# EAGLE design BPS6002_LogicStart_Shield (EAGLE 6.6.0)
DATABASE: E:\Dropbox\GadgetFactory\GadgetFactory_Engineering\Libraries\GadgetFactory-PARTSDB.txt

## Sheet 1 of 7: Pinouts
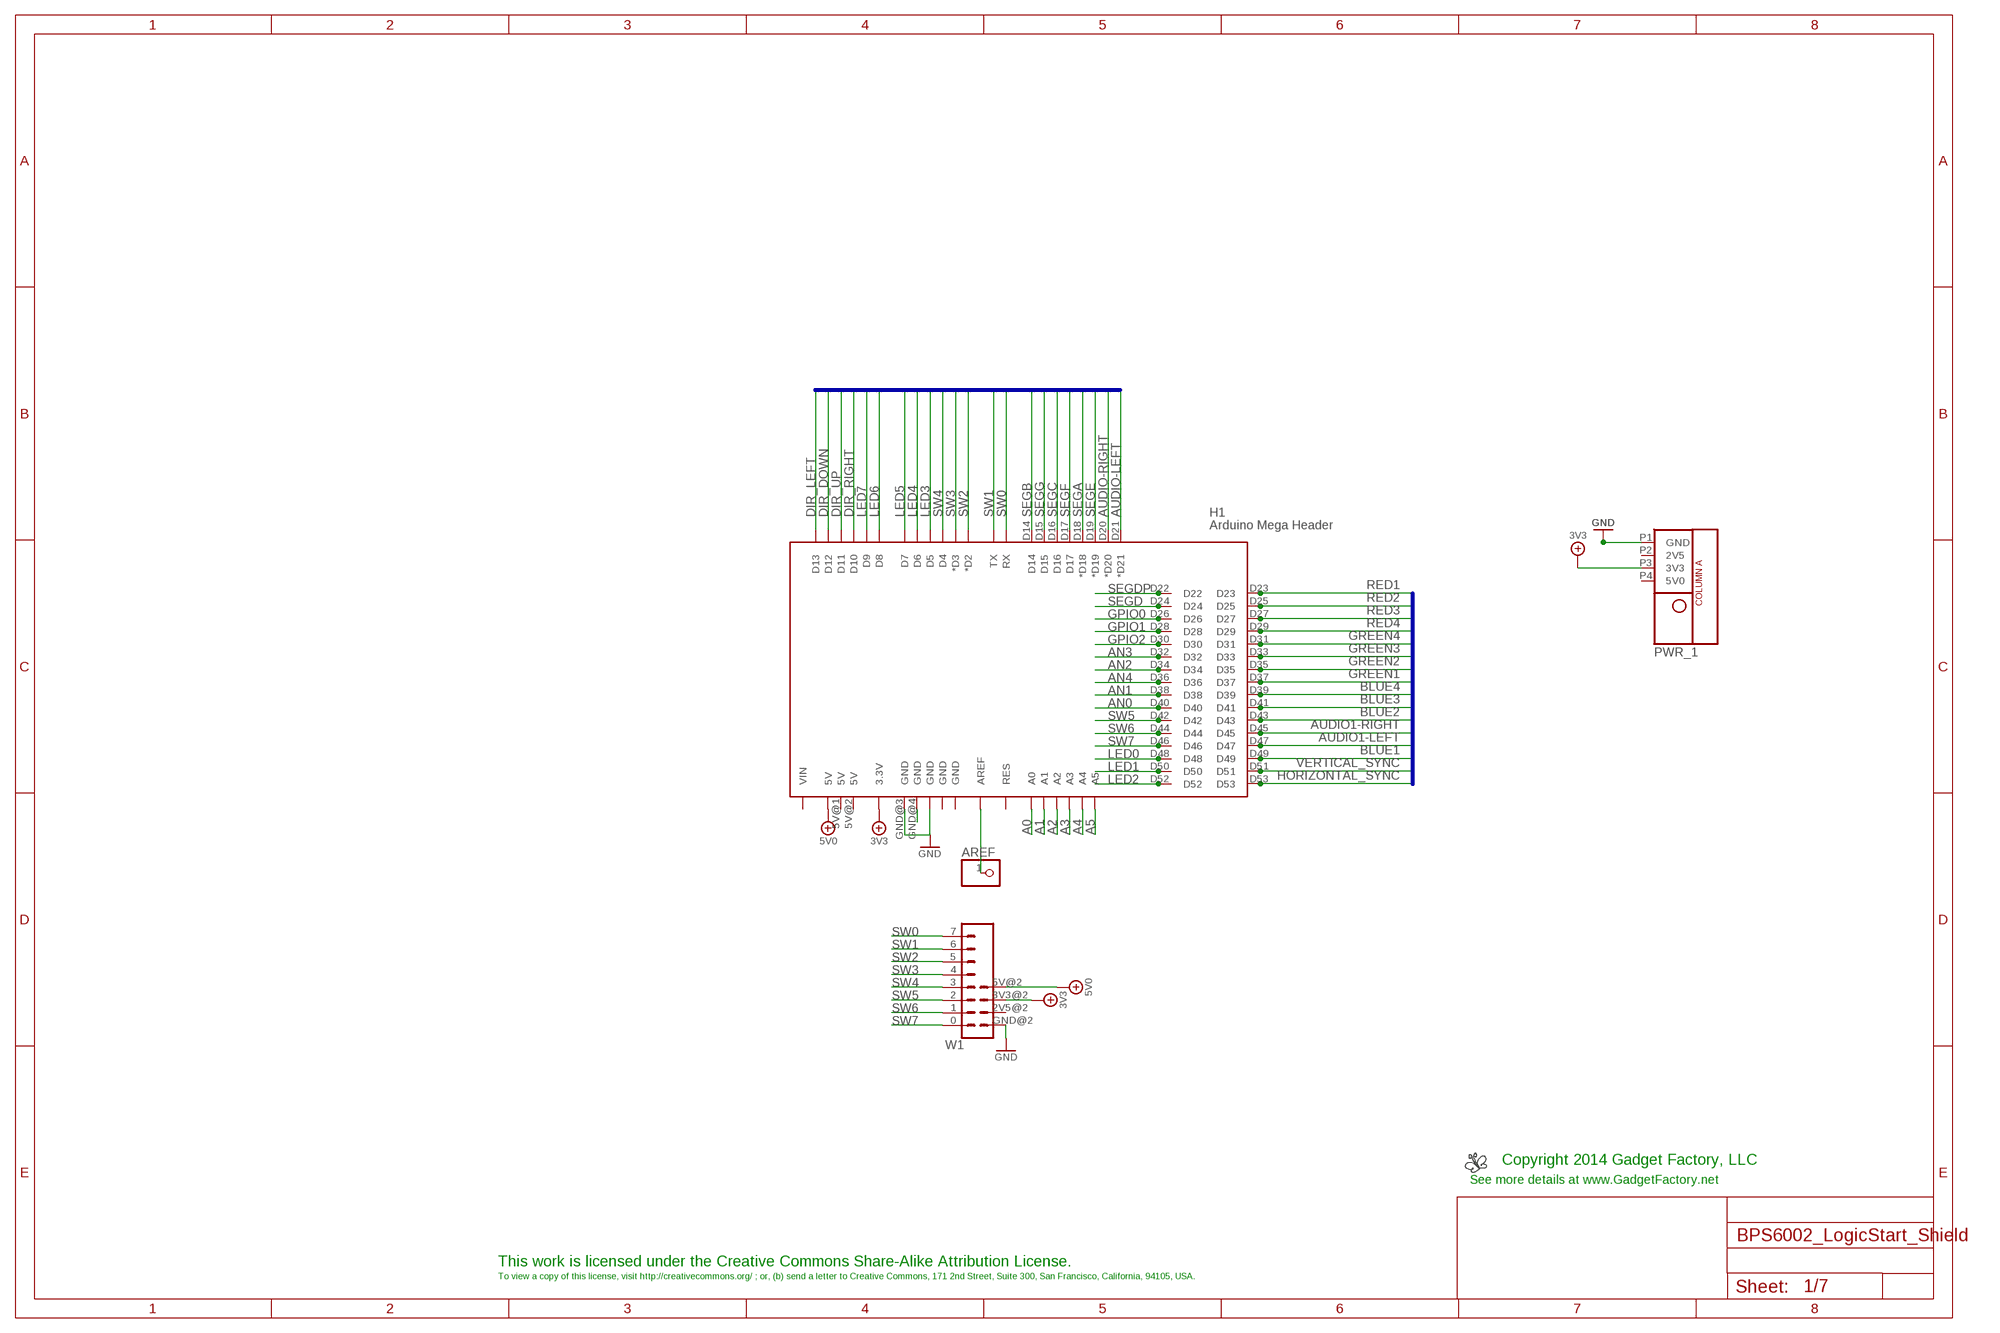
[diagram p0: schematic, sheet 1]

### Parts
AREF  PINHD-1X1  [1X01]
H1  Arduino Mega Header  PAPILIO_DUO_SHIELD  [PAPILIO_DUO_SHIELD]
LOGO1  BUTTERFLY_LOGO  [BUTTERFLY_LOGO]
PWR_1  POWER_ONLYNOTEXT  [POWER_NO_TEXT]
W1  WING8_NOHOLES_FEMALE_TOP  WING8WING8_NOHOLES  [WINGSIDE_8BIT_NOHOLES]

### Nets
3V3: H1.3.3V W1.3V3@2(3V3) ; also sheet 2,5,6,7
5V0: H1.5V@0(5V) W1.5V@2(5V)
A0: H1.A0 ; also sheet 5
A1: H1.A1 ; also sheet 5
A2: H1.A2 ; also sheet 5
A3: H1.A3 ; also sheet 5
A4: H1.A4 ; also sheet 5
A5: H1.A5 ; also sheet 5
AN0: H1.D40 ; also sheet 6
AN1: H1.D38 ; also sheet 6
AN2: H1.D34 ; also sheet 6
AN3: H1.D32 ; also sheet 6
AN4: H1.D36 ; also sheet 6
AUDIO1-LEFT: H1.D47
AUDIO1-RIGHT: H1.D45
AUDIO-LEFT: H1.D21(*D21) ; also sheet 3
AUDIO-RIGHT: H1.D20(*D20) ; also sheet 3
BLUE1: H1.D49 ; also sheet 4
BLUE2: H1.D43 ; also sheet 4
BLUE3: H1.D41 ; also sheet 4
BLUE4: H1.D39 ; also sheet 4
DIR_DOWN: H1.D12 ; also sheet 7
DIR_LEFT: H1.D13 ; also sheet 7
DIR_RIGHT: H1.D10 ; also sheet 7
DIR_UP: H1.D11 ; also sheet 7
GND: H1.GND@2(GND) H1.GND@3(GND) W1.GND@2(GND) ; also sheet 2,3,5,7
GPIO0: H1.D26 ; also sheet 2
GPIO1: H1.D28 ; also sheet 2
GPIO2: H1.D30 ; also sheet 2
GREEN1: H1.D37 ; also sheet 4
GREEN2: H1.D35 ; also sheet 4
GREEN3: H1.D33 ; also sheet 4
GREEN4: H1.D31 ; also sheet 4
HORIZONTAL_SYNC: H1.D53 ; also sheet 4
LED0: H1.D48 ; also sheet 2
LED1: H1.D50 ; also sheet 2
LED2: H1.D52 ; also sheet 2
LED3: H1.D5 ; also sheet 2
LED4: H1.D6 ; also sheet 2
LED5: H1.D7 ; also sheet 2
LED6: H1.D8 ; also sheet 2
LED7: H1.D9 ; also sheet 2
N$9: AREF.1 H1.AREF
RED1: H1.D23 ; also sheet 4
RED2: H1.D25 ; also sheet 4
RED3: H1.D27 ; also sheet 4
RED4: H1.D29 ; also sheet 4
SEGA: H1.D18(*D18) ; also sheet 6
SEGB: H1.D14 ; also sheet 6
SEGC: H1.D16 ; also sheet 6
SEGD: H1.D24 ; also sheet 6
SEGDP: H1.D22 ; also sheet 6
SEGE: H1.D19(*D19) ; also sheet 6
SEGF: H1.D17 ; also sheet 6
SEGG: H1.D15 ; also sheet 6
SW0: H1.RX W1.7 ; also sheet 2
SW1: H1.TX W1.6 ; also sheet 2
SW2: H1.D2(*D2) W1.5 ; also sheet 2
SW3: H1.D3(*D3) W1.4 ; also sheet 2
SW4: H1.D4 W1.3 ; also sheet 2
SW5: H1.D42 W1.2 ; also sheet 2
SW6: H1.D44 W1.1 ; also sheet 2
SW7: H1.D46 W1.0 ; also sheet 2
VERTICAL_SYNC: H1.D51 ; also sheet 4
WING_3V3: PWR_1.P3(3V3) ; supply symbol labelled 3V3
WING_GND: H1.GND@4(GND) PWR_1.P1(GND) ; supply symbol labelled GND ; also sheet 4
Unconnected: H1.5V@1(5V) H1.5V@2(5V) H1.GND@0(GND) H1.GND@1(GND) H1.RES H1.VIN PWR_1.P2(2V5) PWR_1.P4(5V0) W1.2V5@2(2V5)

### Buses
LED[1..4],JS1_[1..9],JS2_[1..9],AUDIO-,AUDIO+,PS2CLK1,PS2CLK2,PS2DAT1,PS2DAT2,RED[1..4],GREEN[1..4],BLUE[1..4],SW[1..4],RESET,HORIZONTAL_SYNC

### Notes on the sheet
- Copyright 2014 Gadget Factory, LLC
- See more details at www.GadgetFactory.net
- This work is licensed under the Creative Commons Share-Alike Attribution License.
- To view a copy of this license, visit http://creativecommons.org/ ; or, (b) send a letter to Creative Commons, 171 2nd Street, Suite 300, San Francisco, California, 94105, USA.

## Sheet 2 of 7: Switches/LEDs
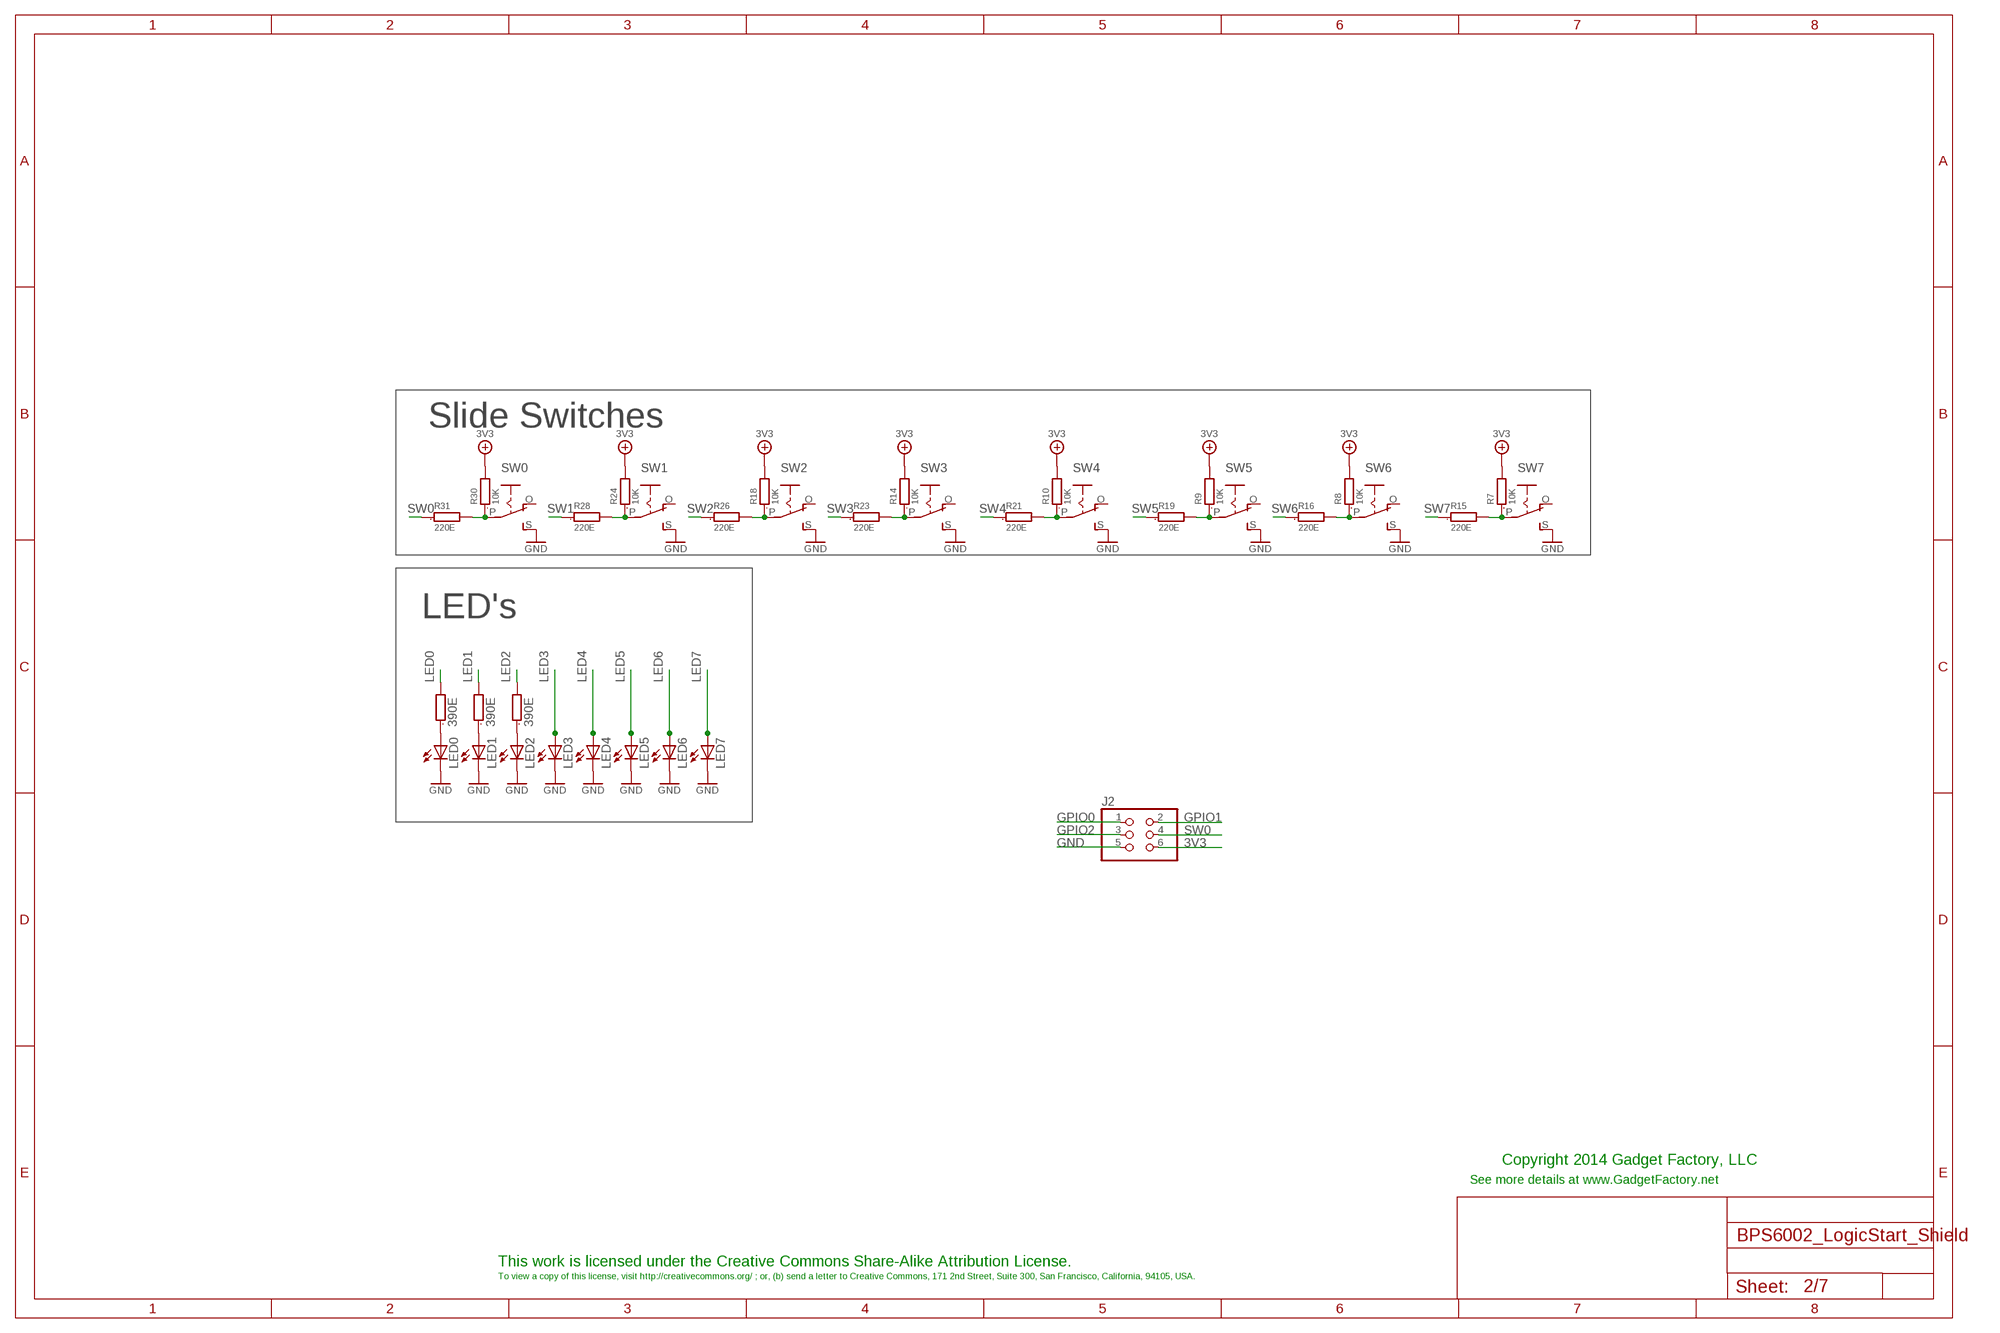
[diagram p1: schematic, sheet 2]

### Parts
J2  PINHD-2X3  [2X03]
LED0  LEDCHIPLED_0805  [CHIPLED_0805]
LED1  LEDCHIPLED_0805  [CHIPLED_0805]
LED2  LEDCHIPLED_0805  [CHIPLED_0805]
LED3  LEDCHIPLED_0805  [CHIPLED_0805]
LED4  LEDCHIPLED_0805  [CHIPLED_0805]
LED5  LEDCHIPLED_0805  [CHIPLED_0805]
LED6  LEDCHIPLED_0805  [CHIPLED_0805]
LED7  LEDCHIPLED_0805  [CHIPLED_0805]
R7  10K  R0603  [0603]
R8  10K  R0603  [0603]
R9  10K  R0603  [0603]
R10  10K  R0603  [0603]
R11  390E  R0603  [0603]
R12  390E  R0603  [0603]
R13  390E  R0603  [0603]
R14  10K  R0603  [0603]
R15  220E  R0603  [0603]
R16  220E  R0603  [0603]
R18  10K  R0603  [0603]
R19  220E  R0603  [0603]
R21  220E  R0603  [0603]
R23  220E  R0603  [0603]
R24  10K  R0603  [0603]
R26  220E  R0603  [0603]
R28  220E  R0603  [0603]
R30  10K  R0603  [0603]
R31  220E  R0603  [0603]
SW0  EG1218S  [EG1218]
SW1  EG1218S  [EG1218]
SW2  EG1218S  [EG1218]
SW3  EG1218S  [EG1218]
SW4  EG1218S  [EG1218]
SW5  EG1218S  [EG1218]
SW6  EG1218S  [EG1218]
SW7  EG1218S  [EG1218]

### Nets
3V3: J2.6 R7.2 R8.2 R9.2 R10.2 R14.2 R18.2 R24.2 R30.2 ; also sheet 1,5,6,7
GND: J2.5 LED0.C LED1.C LED2.C LED3.C LED4.C LED5.C LED6.C LED7.C SW0.S SW1.S SW2.S SW3.S SW4.S SW5.S SW6.S SW7.S ; also sheet 1,3,5,7
GPIO0: J2.1 ; also sheet 1
GPIO1: J2.2 ; also sheet 1
GPIO2: J2.3 ; also sheet 1
LED0: R13.2 ; also sheet 1
LED1: R12.2 ; also sheet 1
LED2: R11.2 ; also sheet 1
LED3: LED3.A ; also sheet 1
LED4: LED4.A ; also sheet 1
LED5: LED5.A ; also sheet 1
LED6: LED6.A ; also sheet 1
LED7: LED7.A ; also sheet 1
N$19: LED0.A R13.1
N$20: LED1.A R12.1
N$21: LED2.A R11.1
SW0: J2.4 R31.1 ; also sheet 1
SW0_JOY_UP_IN: R30.1 R31.2 SW0.P
SW1: R28.1 ; also sheet 1
SW1__JOY_DOWN_IN: R24.1 R28.2 SW1.P
SW2: R26.1 ; also sheet 1
SW2_JOY_SELECT_IN: R18.1 R26.2 SW2.P
SW3: R23.1 ; also sheet 1
SW3_JOY_RIGHT_IN: R14.1 R23.2 SW3.P
SW4: R21.1 ; also sheet 1
SW4_JOY_LEFT_IN: R10.1 R21.2 SW4.P
SW5: R19.1 ; also sheet 1
SW5_IN: R9.1 R19.2 SW5.P
SW6: R16.1 ; also sheet 1
SW6_IN: R8.1 R16.2 SW6.P
SW7: R15.1 ; also sheet 1
SW7_IN: R7.1 R15.2 SW7.P
Unconnected: SW0.O SW1.O SW2.O SW3.O SW4.O SW5.O SW6.O SW7.O

### Notes on the sheet
- Slide Switches
- LED's
- Copyright 2014 Gadget Factory, LLC
- See more details at www.GadgetFactory.net
- This work is licensed under the Creative Commons Share-Alike Attribution License.
- To view a copy of this license, visit http://creativecommons.org/ ; or, (b) send a letter to Creative Commons, 171 2nd Street, Suite 300, San Francisco, California, 94105, USA.

## Sheet 3 of 7: Audio
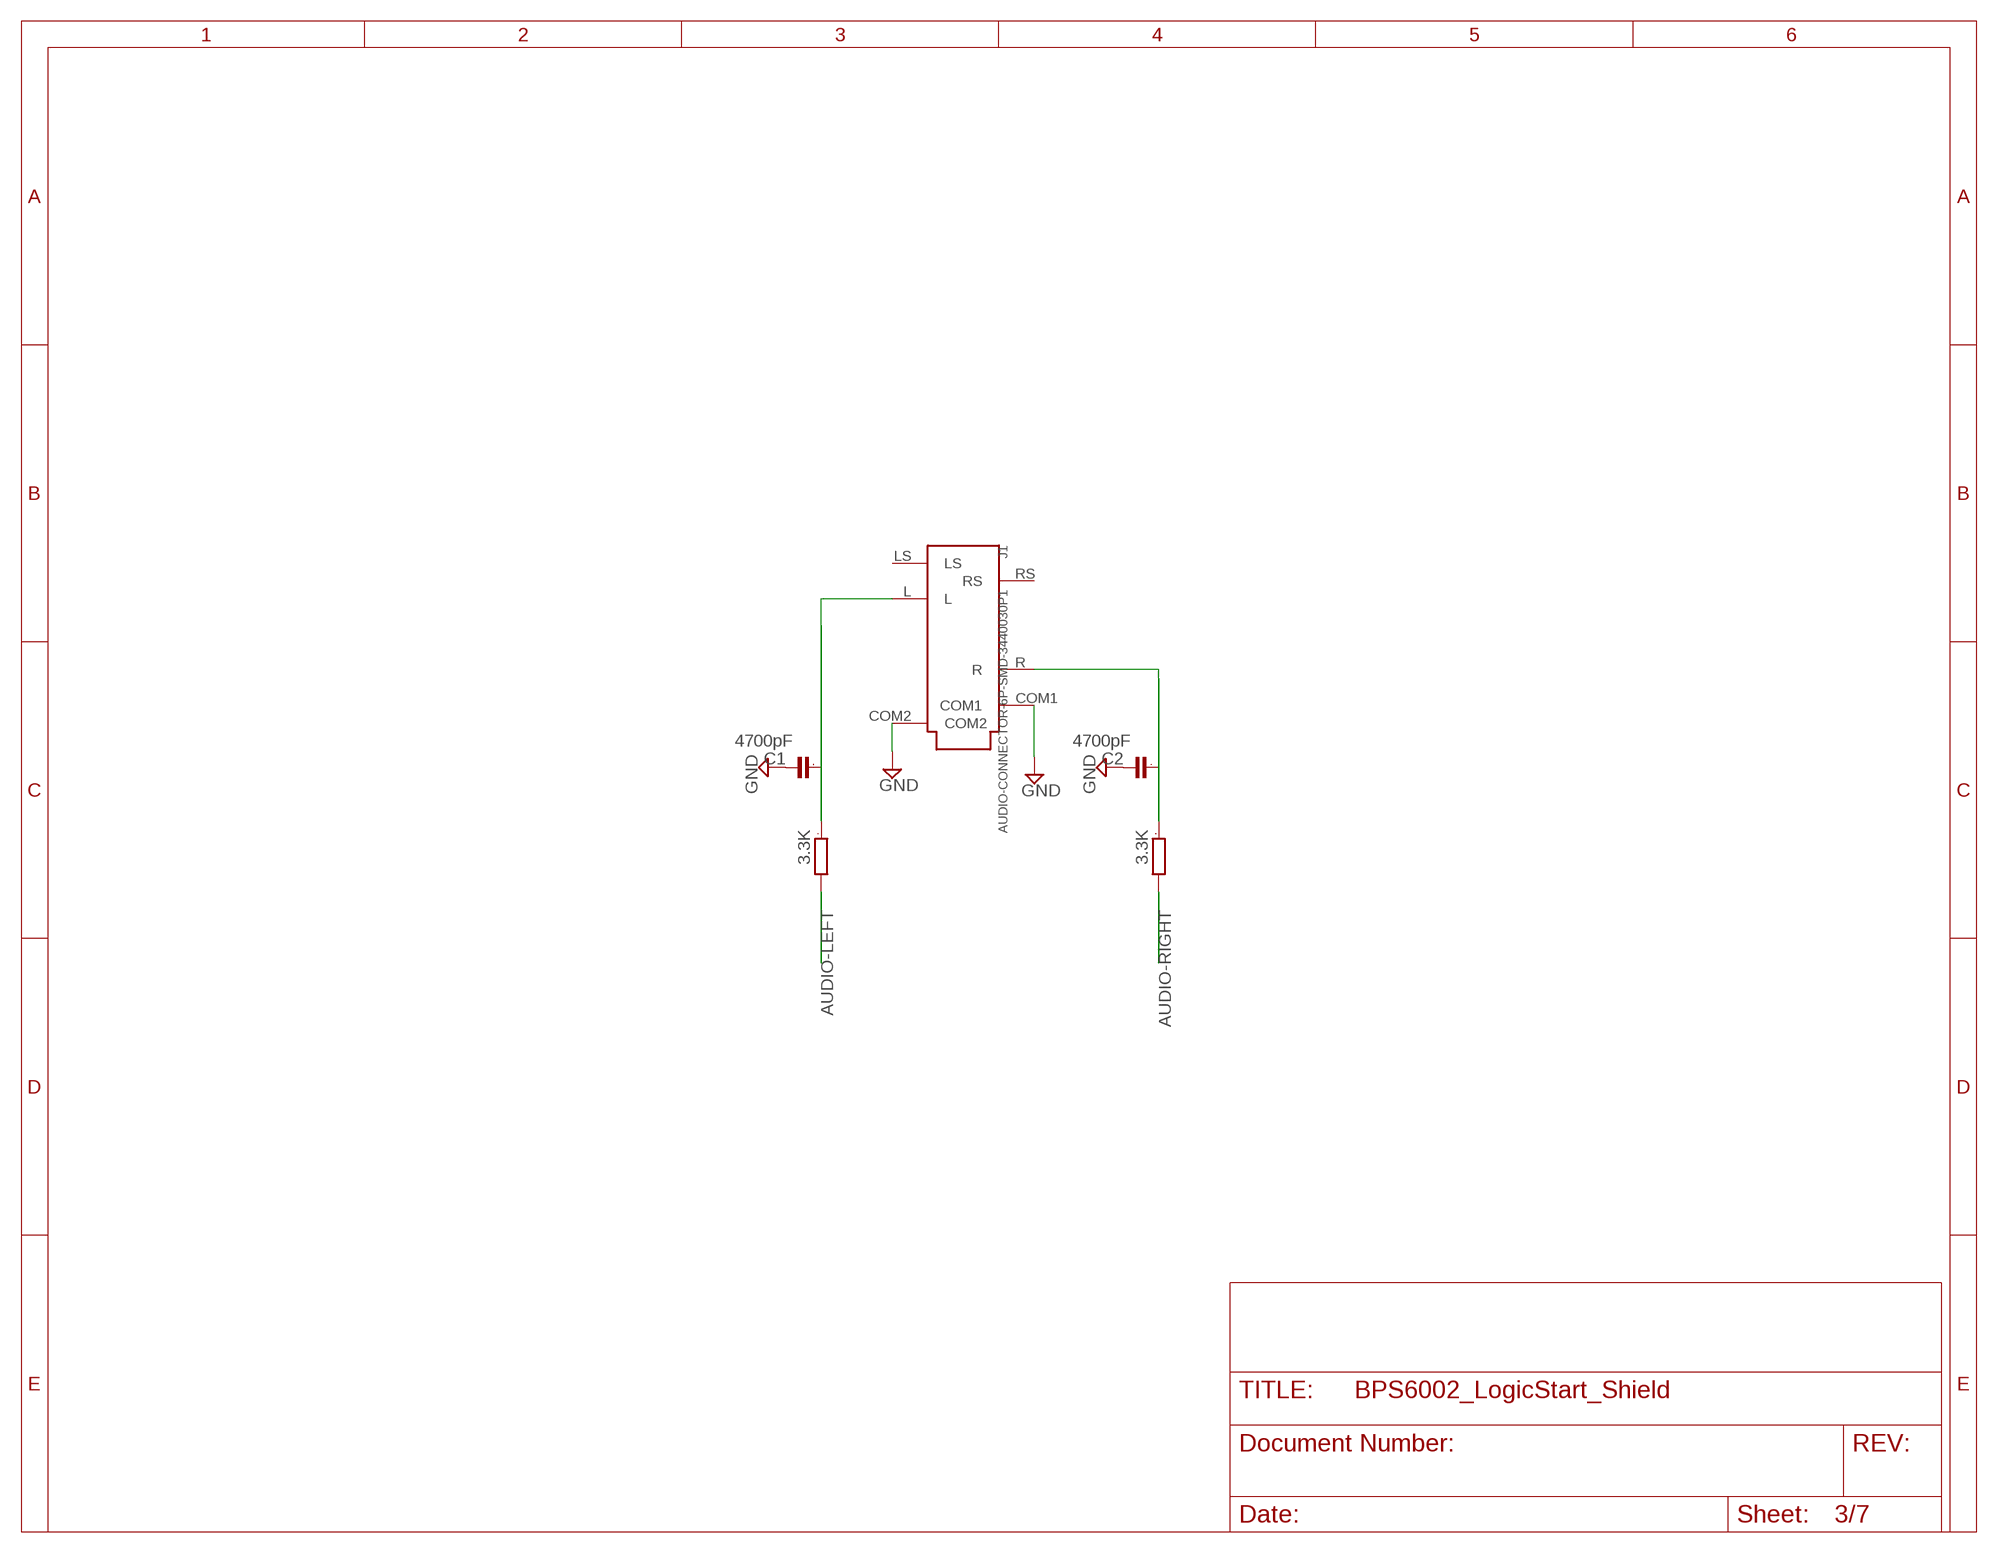
[diagram p2: schematic, sheet 3]

### Parts
C1  4700pF  C0603  [0603]
C2  4700pF  C0603  [0603]
J1  AUDIO-CONNECTOR-6P-SMD-3440030P1  [6P-SMD-3.5]
R2  3.3K  R0603  [0603]
R3  3.3K  R0603  [0603]

### Nets
AUDIO-LEFT: R2.2 ; also sheet 1
AUDIO-RIGHT: R3.2 ; also sheet 1
GND: C1.2 C2.2 J1.COM1 J1.COM2 ; also sheet 1,2,5,7
N$1: C1.1 J1.L R2.1
N$33: C2.1 J1.R R3.1
Unconnected: J1.LS J1.RS

## Sheet 4 of 7: VGA
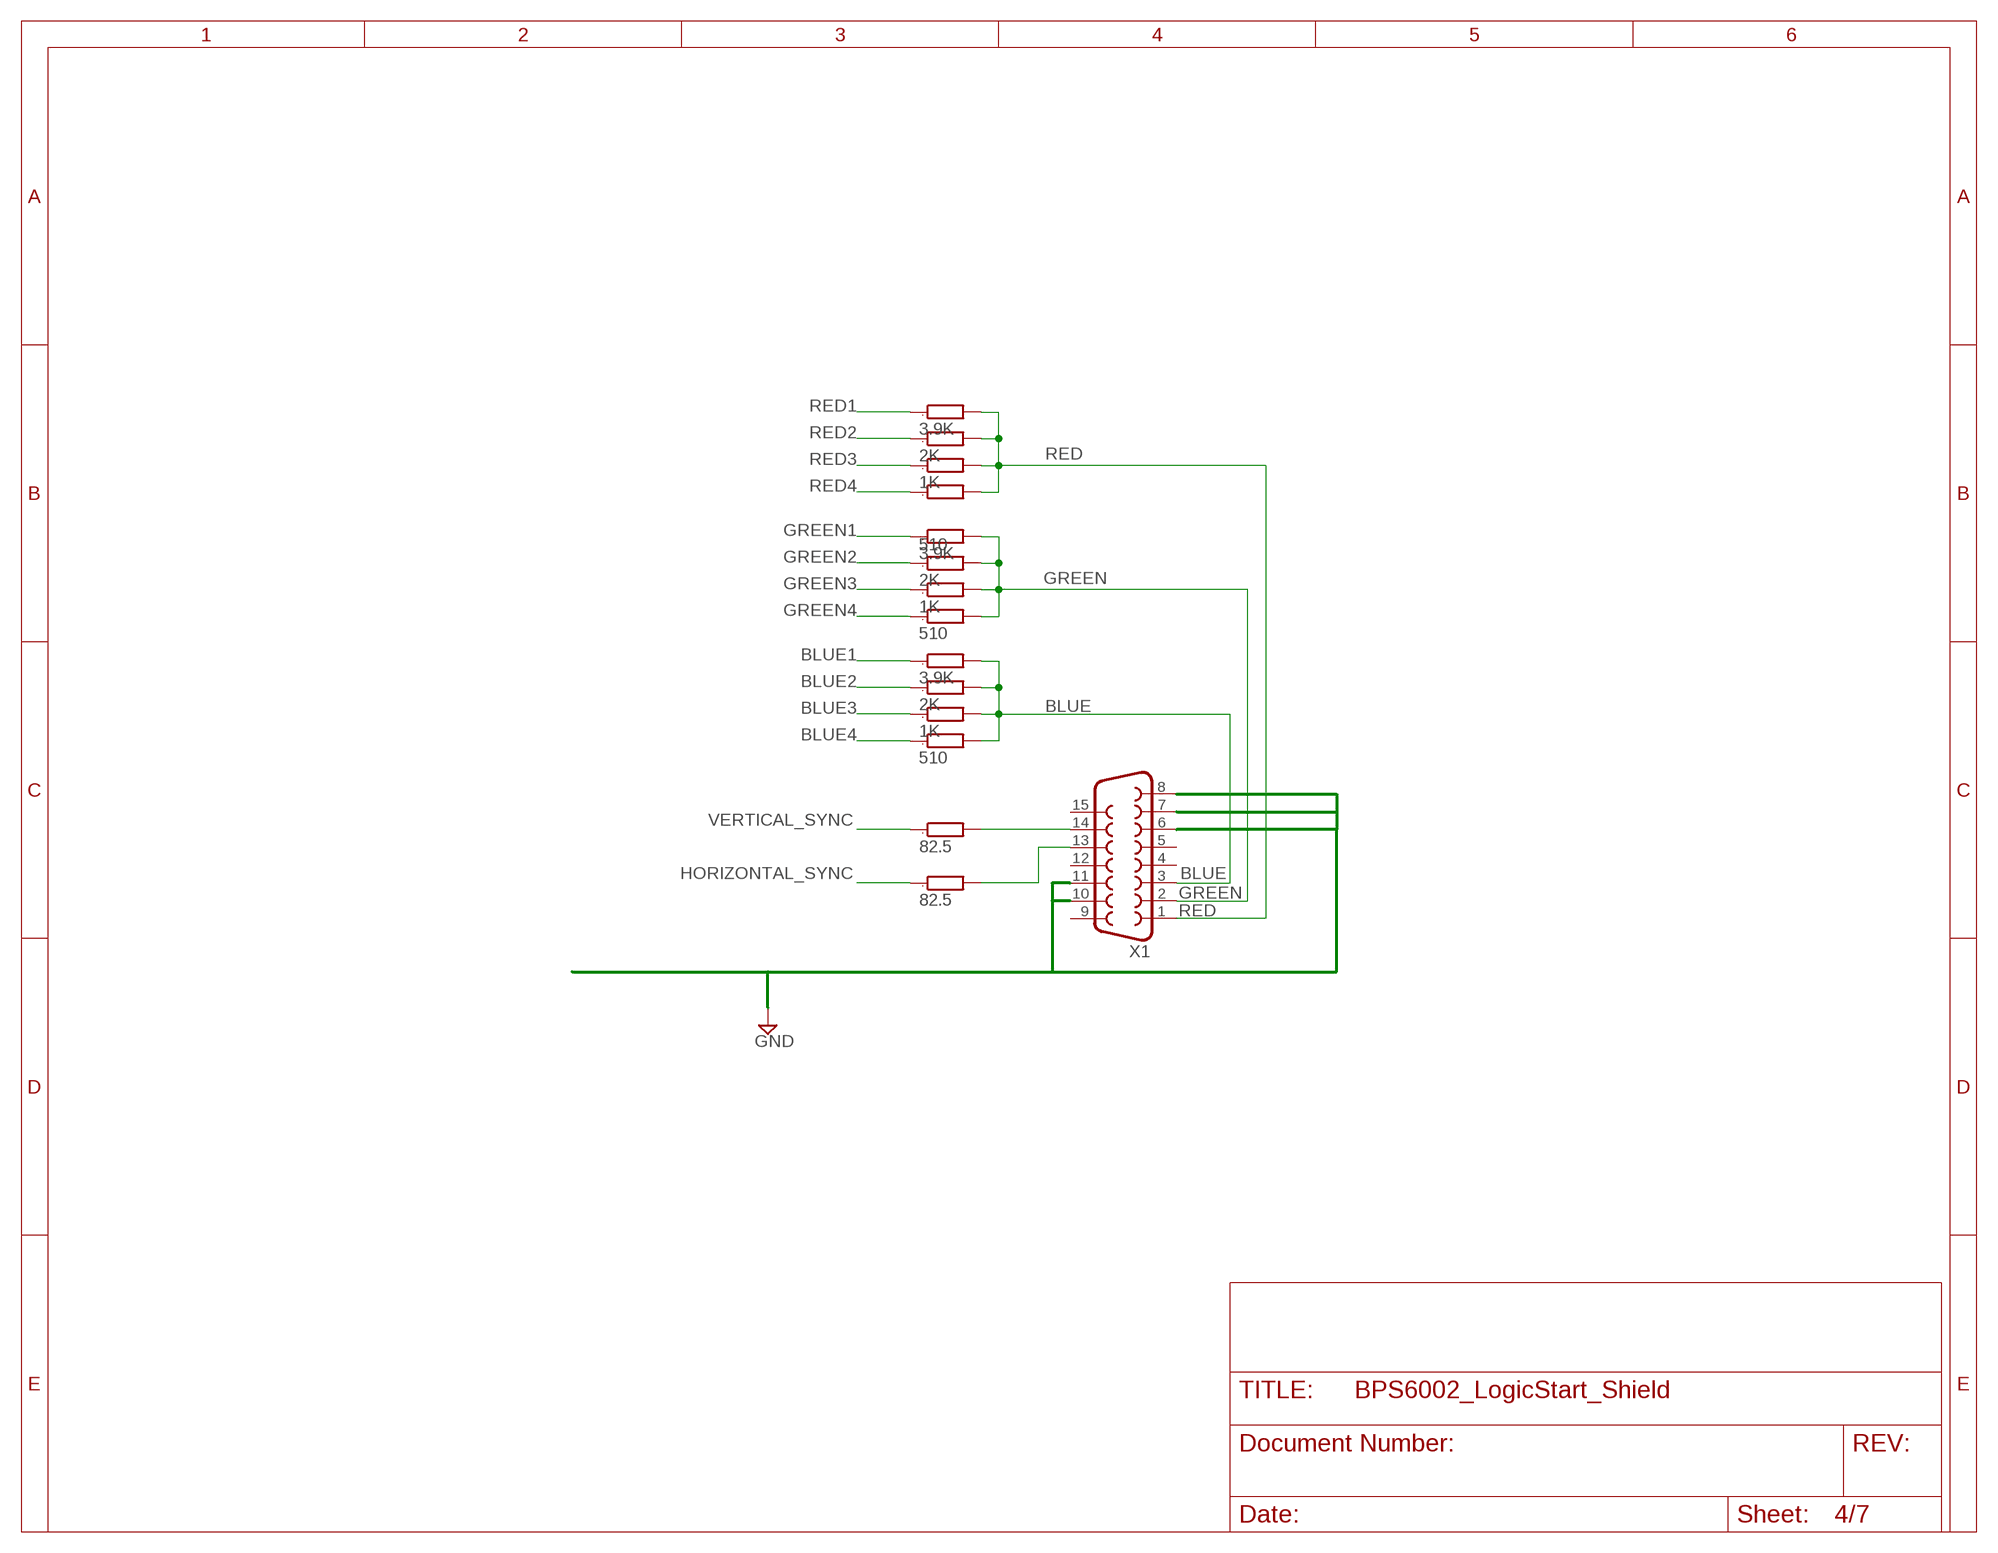
[diagram p3: schematic, sheet 4]

### Parts
R34  3.9K  R0603  [0603]
R35  2K  R0603  [0603]
R36  1K  R0603  [0603]
R37  510  R0603  [0603]
R38  510  R0603  [0603]
R39  1K  R0603  [0603]
R40  2K  R0603  [0603]
R41  3.9K  R0603  [0603]
R42  510  R0603  [0603]
R43  1K  R0603  [0603]
R44  2K  R0603  [0603]
R45  3.9K  R0603  [0603]
R46  82.5  R0603  [0603]
R47  82.5  R0603  [0603]
X1  F15HDH  [HDF15H]

### Nets
BLUE: R42.2 R43.2 R44.2 R45.2 X1.3
BLUE1: R45.1 ; also sheet 1
BLUE2: R44.1 ; also sheet 1
BLUE3: R43.1 ; also sheet 1
BLUE4: R42.1 ; also sheet 1
GREEN: R38.2 R39.2 R40.2 R41.2 X1.2
GREEN1: R41.1 ; also sheet 1
GREEN2: R40.1 ; also sheet 1
GREEN3: R39.1 ; also sheet 1
GREEN4: R38.1 ; also sheet 1
HORIZONTAL_SYNC: R47.1 ; also sheet 1
N$4: R47.2 X1.13
N$5: R46.2 X1.14
RED: R34.2 R35.2 R36.2 R37.2 X1.1
RED1: R34.1 ; also sheet 1
RED2: R35.1 ; also sheet 1
RED3: R36.1 ; also sheet 1
RED4: R37.1 ; also sheet 1
VERTICAL_SYNC: R46.1 ; also sheet 1
WING_GND: X1.6 X1.7 X1.8 X1.10 X1.11 ; supply symbol labelled GND ; also sheet 1
Unconnected: X1.4 X1.5 X1.9 X1.12 X1.15

## Sheet 5 of 7: ANALOG
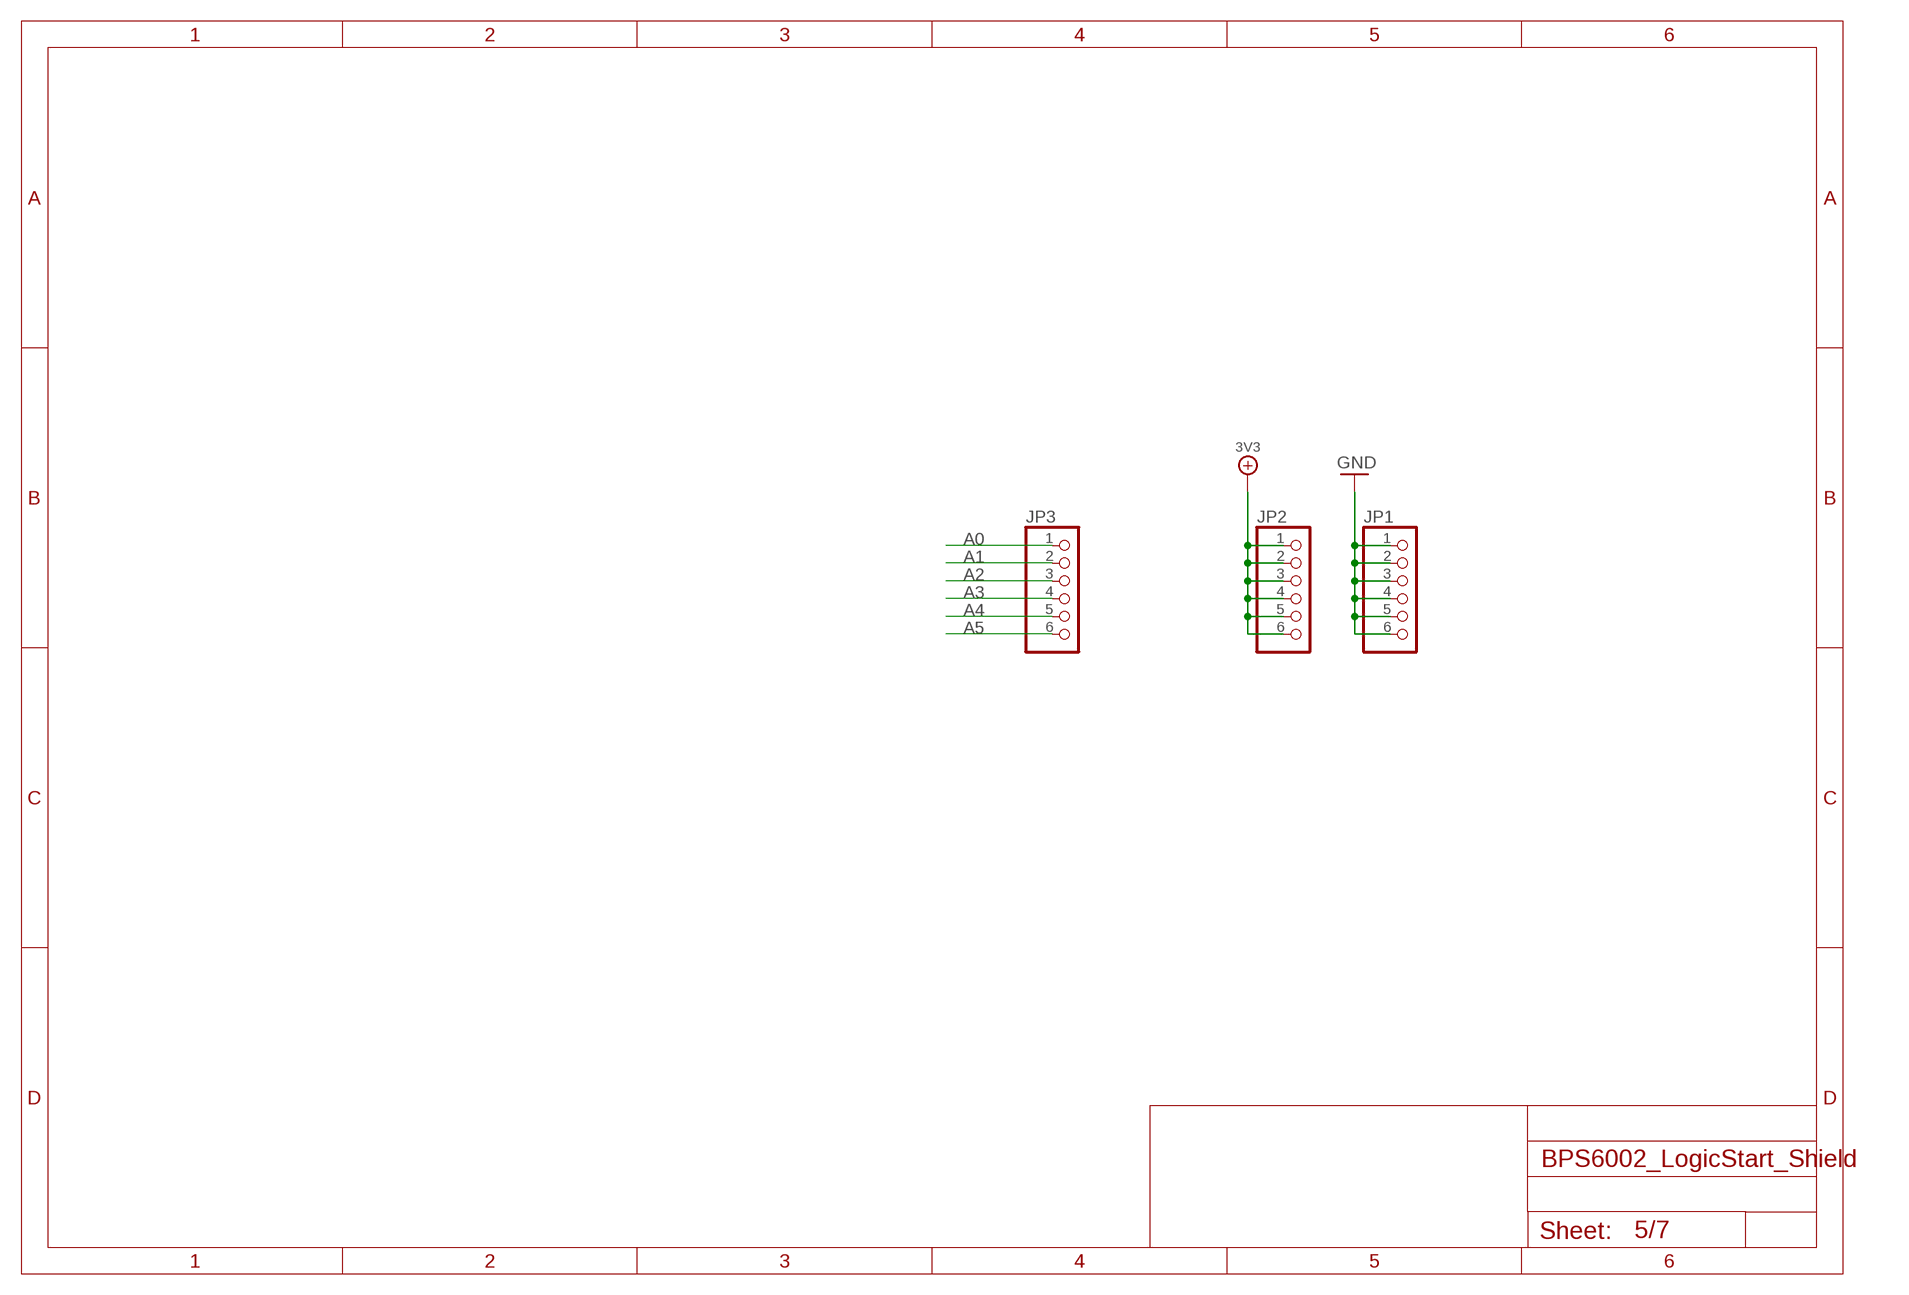
[diagram p4: schematic, sheet 5]

### Parts
JP1  PINHD-1X6  [1X06]
JP2  PINHD-1X6  [1X06]
JP3  PINHD-1X6  [1X06]

### Nets
3V3: JP2.1 JP2.2 JP2.3 JP2.4 JP2.5 JP2.6 ; also sheet 1,2,6,7
A0: JP3.1 ; also sheet 1
A1: JP3.2 ; also sheet 1
A2: JP3.3 ; also sheet 1
A3: JP3.4 ; also sheet 1
A4: JP3.5 ; also sheet 1
A5: JP3.6 ; also sheet 1
GND: JP1.1 JP1.2 JP1.3 JP1.4 JP1.5 JP1.6 ; also sheet 1,2,3,7

## Sheet 6 of 7: Seven Segment LCD
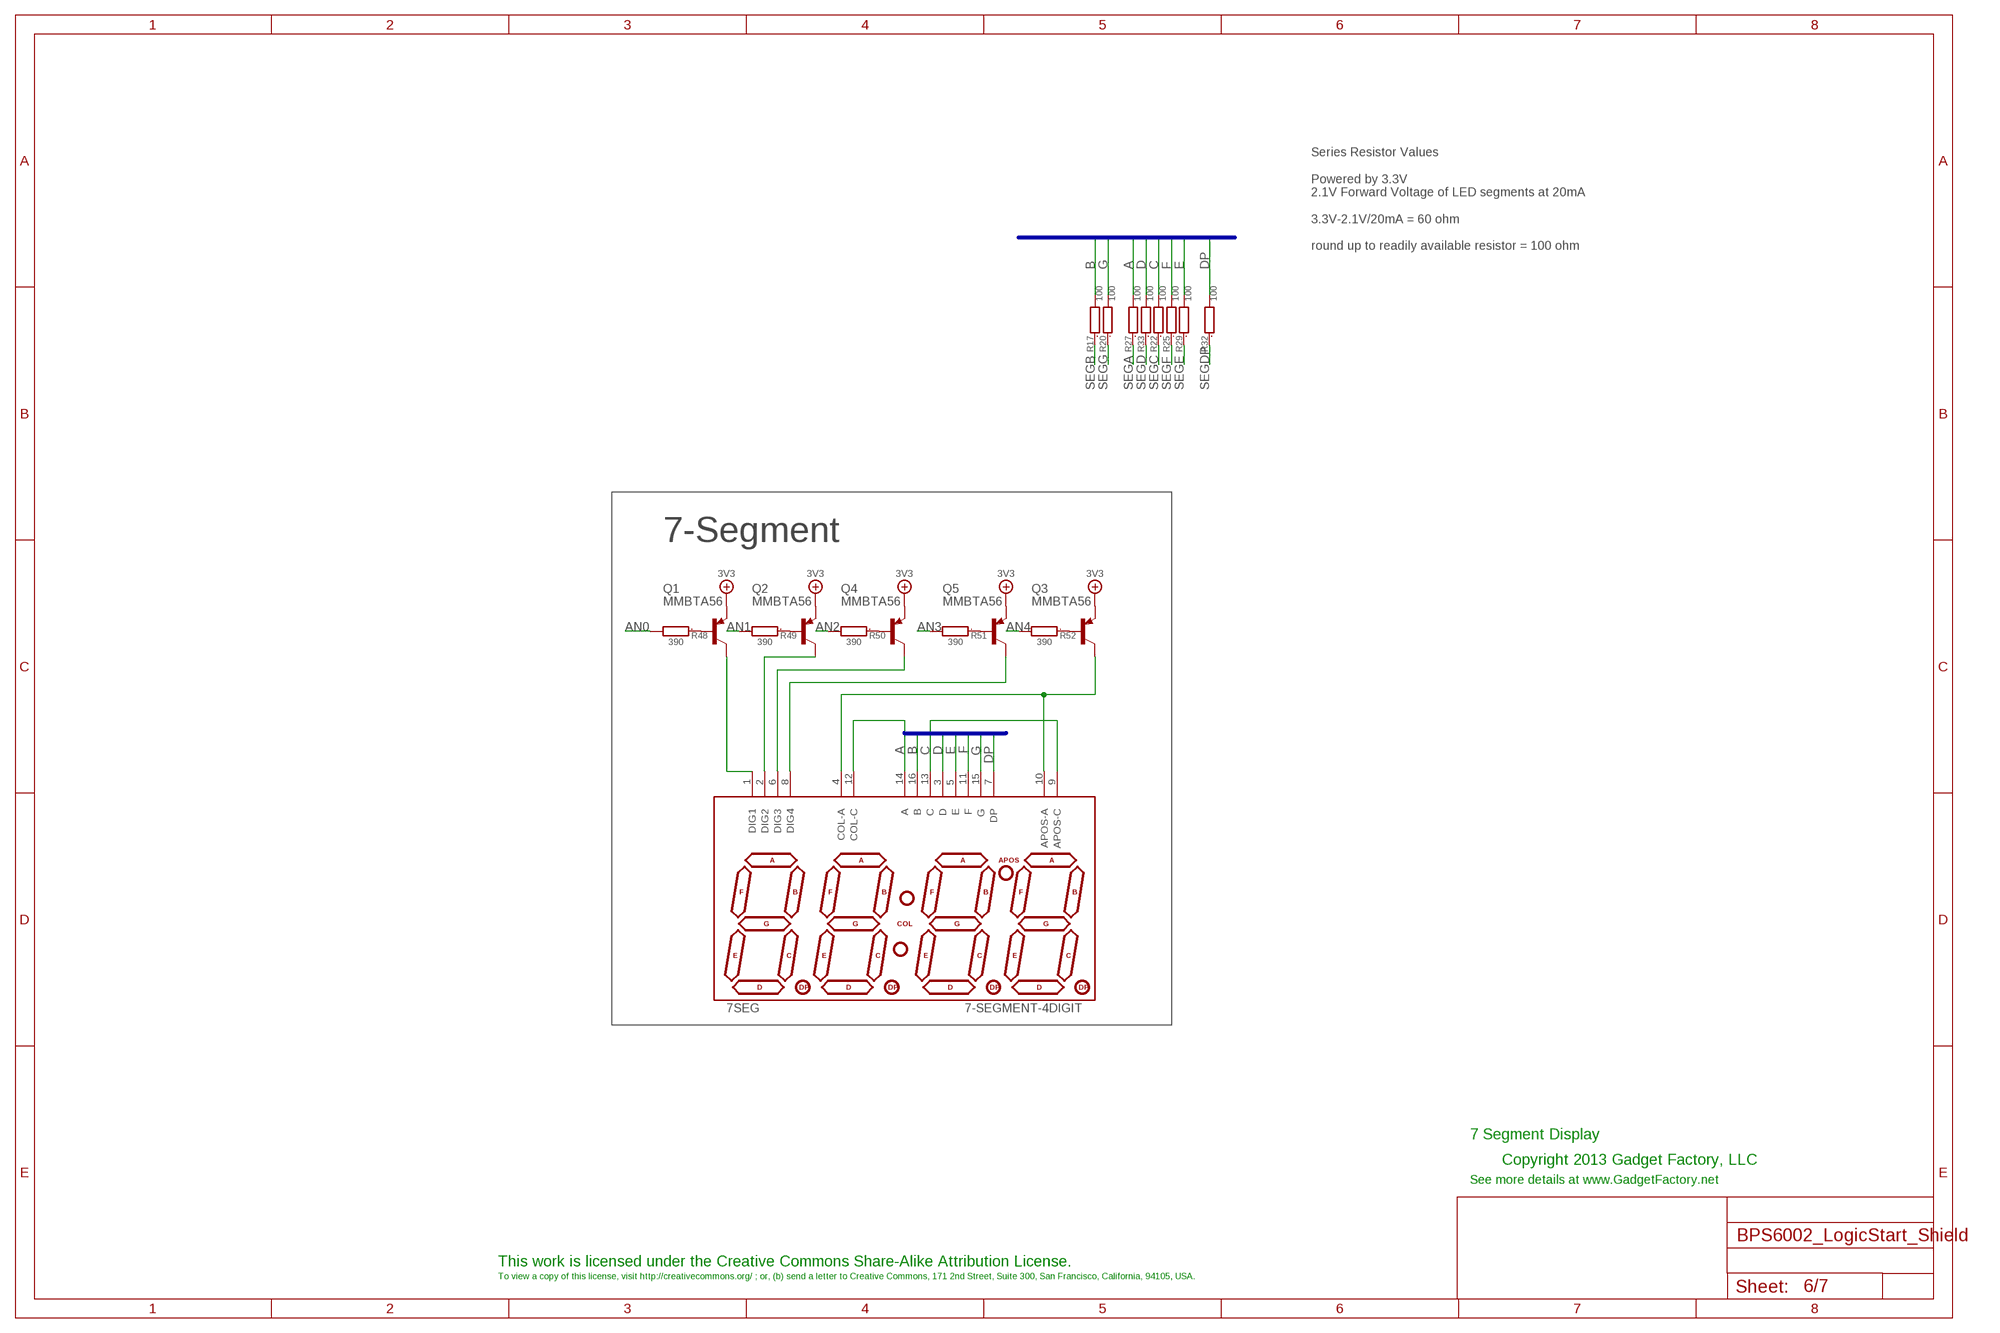
[diagram p5: schematic, sheet 6]

### Parts
7SEG  7-SEGMENT-4DIGIT  [7-SEGMENT-4DIGIT]
Q1  MMBTA56  MMBTA56-SOT23  [SOT23]
Q2  MMBTA56  MMBTA56-SOT23  [SOT23]
Q3  MMBTA56  MMBTA56-SOT23  [SOT23]
Q4  MMBTA56  MMBTA56-SOT23  [SOT23]
Q5  MMBTA56  MMBTA56-SOT23  [SOT23]
R17  100  R0603  [0603]
R20  100  R0603  [0603]
R22  100  R0603  [0603]
R25  100  R0603  [0603]
R27  100  R0603  [0603]
R29  100  R0603  [0603]
R32  100  R0603  [0603]
R33  100  R0603  [0603]
R48  390  R0603  [0603]
R49  390  R0603  [0603]
R50  390  R0603  [0603]
R51  390  R0603  [0603]
R52  390  R0603  [0603]

### Nets
3V3: Q1.2(E) Q2.2(E) Q3.2(E) Q4.2(E) Q5.2(E) ; also sheet 1,2,5,7
A: 7SEG.12(COL-C) 7SEG.14(A) R27.2
AN0: R48.2 ; also sheet 1
AN1: R49.2 ; also sheet 1
AN2: R50.2 ; also sheet 1
AN3: R51.2 ; also sheet 1
AN4: R52.2 ; also sheet 1
APOS_A: 7SEG.4(COL-A) 7SEG.10(APOS-A) Q3.3(C)
B: 7SEG.16(B) R17.2
C: 7SEG.9(APOS-C) 7SEG.13(C) R22.2
D: 7SEG.3(D) R33.2
DP: 7SEG.7(DP) R32.2
E: 7SEG.5(E) R29.2
F: 7SEG.11(F) R25.2
G: 7SEG.15(G) R20.2
N$2: Q1.1(B) R48.1
N$3: Q2.1(B) R49.1
N$6: Q4.1(B) R50.1
N$7: Q5.1(B) R51.1
N$8: Q3.1(B) R52.1
N$29: 7SEG.1(DIG1) Q1.3(C)
N$30: 7SEG.2(DIG2) Q2.3(C)
N$31: 7SEG.6(DIG3) Q4.3(C)
N$32: 7SEG.8(DIG4) Q5.3(C)
SEGA: R27.1 ; also sheet 1
SEGB: R17.1 ; also sheet 1
SEGC: R22.1 ; also sheet 1
SEGD: R33.1 ; also sheet 1
SEGDP: R32.1 ; also sheet 1
SEGE: R29.1 ; also sheet 1
SEGF: R25.1 ; also sheet 1
SEGG: R20.1 ; also sheet 1

### Buses
A,B,C,D,E,F,G,DP,COL_A,COL_C,APOS_A,APOS_C
RED[0..2],GREEN[0..2],BLUE[0..1],VERTICAL_SYNC,HORIZONTAL_SYNC,AUDIO,SPI_SCLK,SPI_DIN,SPI_DOUT,SPI_CS,JOY_SELECT,JOY_RIGHT,JOY_LEFT,JOY_DOWN,JOY_UP,AN[0..3],A,B,C,D,E,F,G,DP

### Notes on the sheet
- Series Resistor Values
  
  Powered by 3.3V
  2.1V Forward Voltage of LED segments at 20mA
  
  3.3V-2.1V/20mA = 60 ohm
  
  round up to readily available resistor = 100 ohm
- 7-Segment
- 7 Segment Display
- Copyright 2013 Gadget Factory, LLC
- See more details at www.GadgetFactory.net
- This work is licensed under the Creative Commons Share-Alike Attribution License.
- To view a copy of this license, visit http://creativecommons.org/ ; or, (b) send a letter to Creative Commons, 171 2nd Street, Suite 300, San Francisco, California, 94105, USA.

## Sheet 7 of 7: Directional Buttons
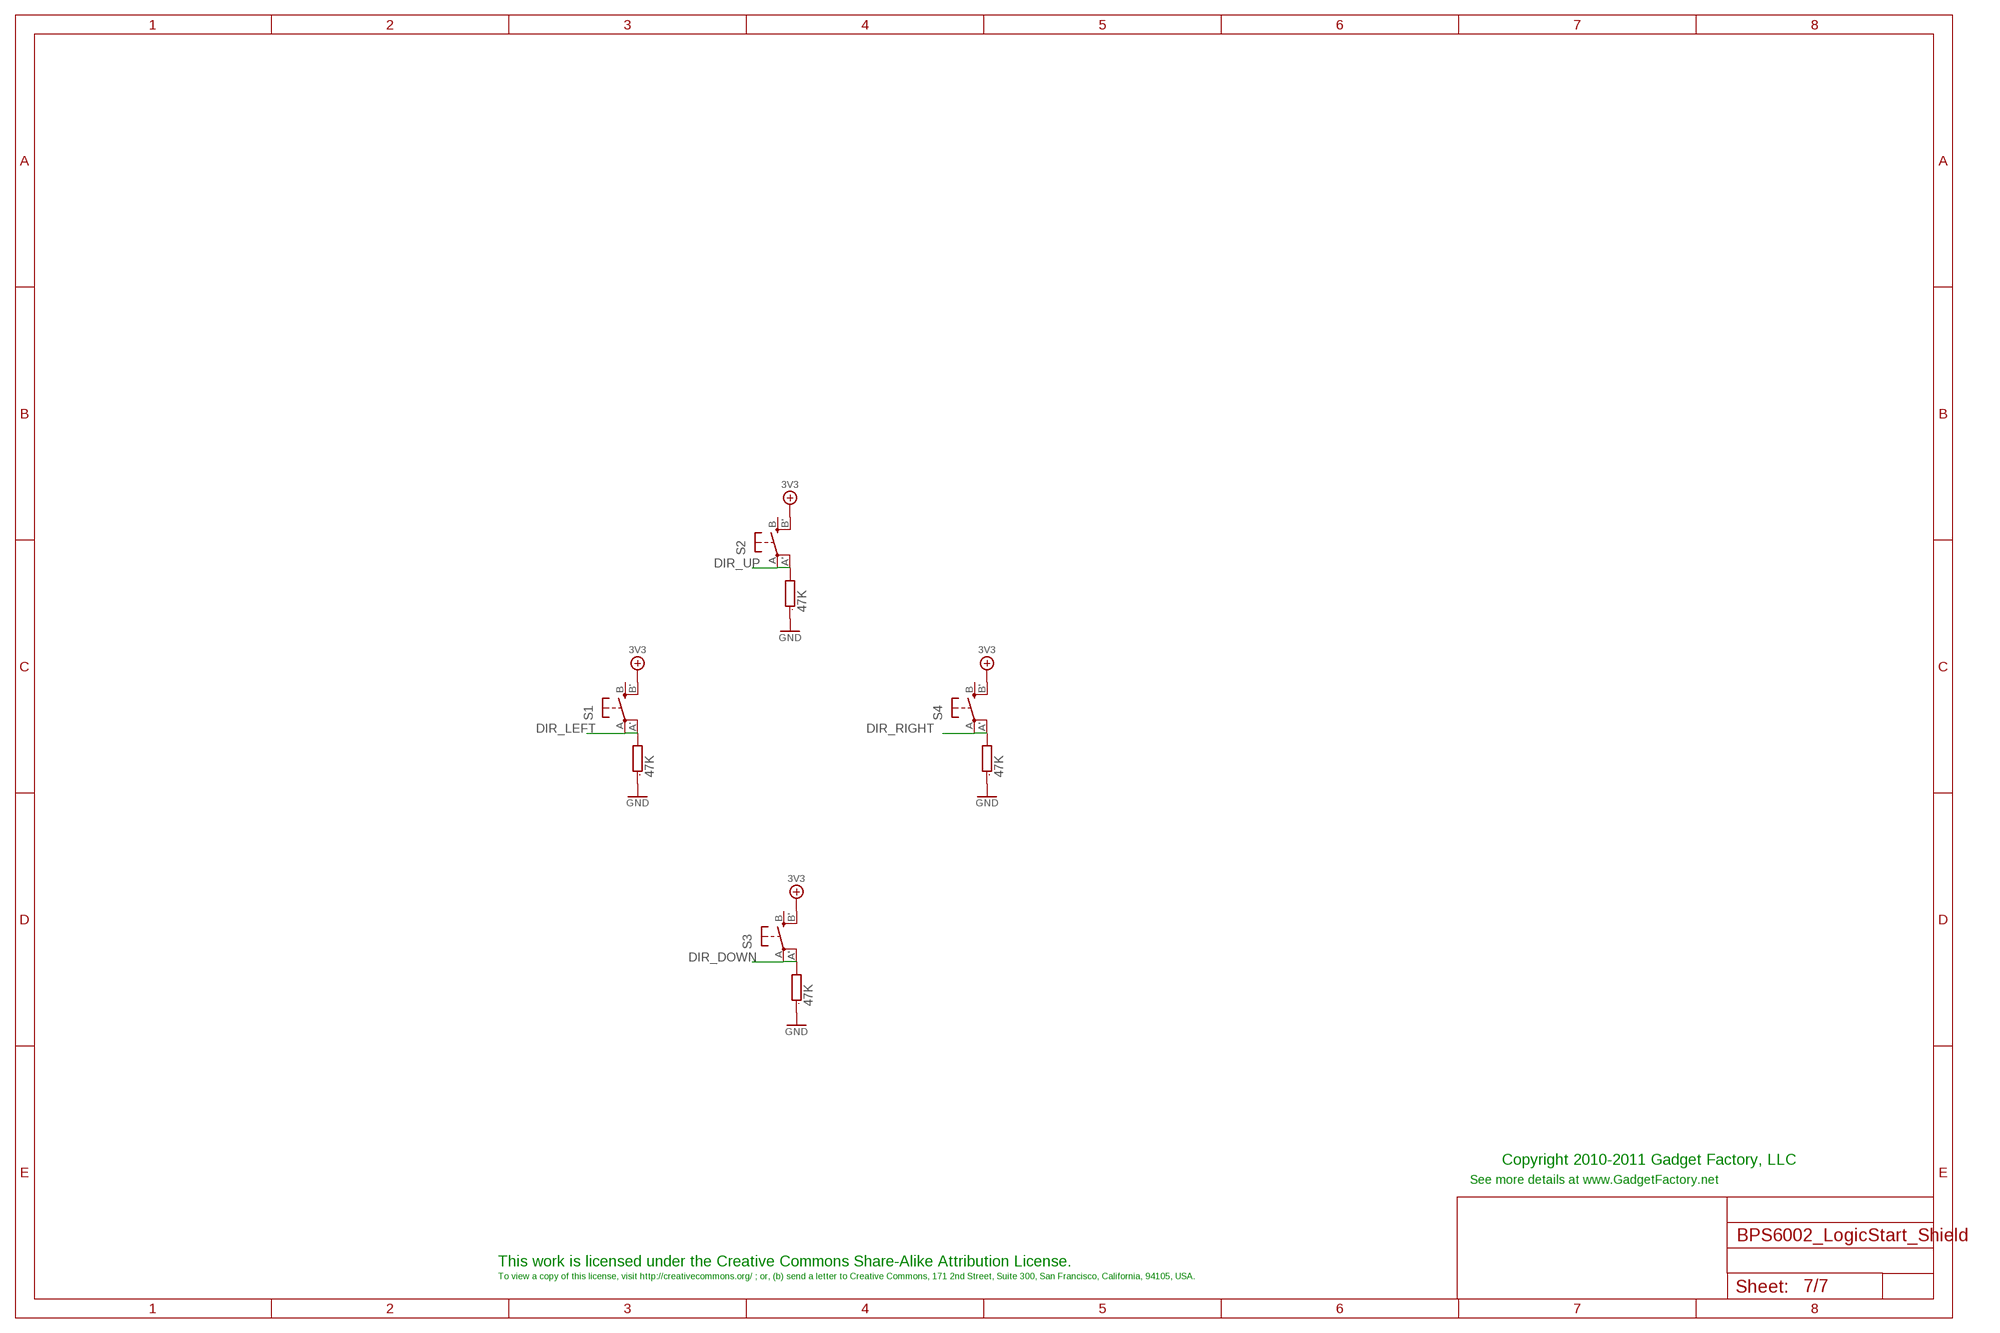
[diagram p6: schematic, sheet 7]

### Parts
R1  47K  R0603  [0603]
R4  47K  R0603  [0603]
R5  47K  R0603  [0603]
R6  47K  R0603  [0603]
S1  EVQQ2  [EVQ-Q2]
S2  EVQQ2  [EVQ-Q2]
S3  EVQQ2  [EVQ-Q2]
S4  EVQQ2  [EVQ-Q2]

### Nets
3V3: S1.B'(S1) S2.B'(S1) S3.B'(S1) S4.B'(S1) ; also sheet 1,2,5,6
DIR_DOWN: R4.2 S3.A'(P1) S3.A(P) ; also sheet 1
DIR_LEFT: R1.2 S1.A'(P1) S1.A(P) ; also sheet 1
DIR_RIGHT: R6.2 S4.A'(P1) S4.A(P) ; also sheet 1
DIR_UP: R5.2 S2.A'(P1) S2.A(P) ; also sheet 1
GND: R1.1 R4.1 R5.1 R6.1 ; also sheet 1,2,3,5
Unconnected: S1.B(S) S2.B(S) S3.B(S) S4.B(S)

### Notes on the sheet
- Copyright 2010-2011 Gadget Factory, LLC
- See more details at www.GadgetFactory.net
- This work is licensed under the Creative Commons Share-Alike Attribution License.
- To view a copy of this license, visit http://creativecommons.org/ ; or, (b) send a letter to Creative Commons, 171 2nd Street, Suite 300, San Francisco, California, 94105, USA.

## Library data of the parts
7SEG = GadgetFactory_Pub_1_0:7-SEGMENT-4DIGIT: This is a part for the 4-Digit 7-segment LEDs from Young Sun. Different from the Digikey LEDs, all 16 pins are used. The LONGPADS Variant is used for a test jig, but you may like it because there is more pad to solder to. If you are concerned about routing space, the standard works just fine though.; PARTNO: AL-D4012BWSR/58-040C
AREF = adafruit:PINHD-1X1: Pin header 1x1 for 0.1" spacing With round pins
C1 C2 = GadgetFactory:C: CAPACITOR, European symbol; PARTNO: C0603C472J5RACTU
H1 = Papilio:PAPILIO_DUO_SHIELD; PARTNO: 65PinHeader
J1 = OPL Eagle Library:AUDIO-CONNECTOR-6P-SMD: When you use the footprint ,place notice 46 (layer)milling ,there is some important information.; PARTNO: 3440030P1
J2 = pinhead:PINHD-2X3: PIN HEADER
JP1-JP3 = adafruit:PINHD-1X6: PIN HEADER; PARTNO: 68000-406HLF
LED0 LED1-LED7 = led:LED: LED OSRAM: - CHIPLED LG R971, LG N971, LY N971, LG Q971, LY Q971, LO R971, LY R971 LH N974, LH R974 LS Q976, LO Q976, LY Q976 LO Q996 - Hyper CHIPLED LW Q18S LB Q993, LB Q99A, LB R99A - SideLED LS A670, LO A670, LY A670, LG A670, LP A670 LB A673, LV A673, LT A673, LW A673 LH A674 LY A675 LS A676, LA A676, LO A676, LY A676, LW A676 LS A679, LY A679, LG A679 - Hyper Micro SIDELED® LS Y876, LA Y876, LO Y876, LY Y876 LT Y87S - SmartLED LW L88C, LW L88S LB L89C, LB L89S, LG L890 LS L89K, LO L89K, LY L89K LS L896, LA L896, LO L896, LY L896 - TOPLED LS T670, LO T670, LY T670, LG T670, LP T670 LSG T670, LSP T670, LSY T670, LOP T670, LYG T670 LG T671, LOG T671, LSG T671 LB T673, LV T673, LT T673, LW T673 LH T674 LS T676, LA T676, LO T676, LY T676, LB T676, LH T676, LSB T676, LW T676 LB T67C, LV T67C, LT T67C, LS T67K, LO T67K, LY T67K, LW E67C LS E67B, LA E67B, LO E67B, LY E67B, LB E67C, LV E67C, LT E67C LW T67C LS T679, LY T679, LG T679 LS T770, LO T770, LY T770, LG T770, LP T770 LB T773, LV T773, LT T773, LW T773 LH T774 LS E675, LA E675, LY E675, LS T675 LS T776, LA T776, LO T776, LY T776, LB T776 LHGB T686 LT T68C, LB T68C - Hyper Mini TOPLED® LB M676 - Mini TOPLED Santana® LG M470 LS M47K, LO M47K, LY M47K Source: http://www.osram.convergy.de LUXEON: - LUMILED® LXK2-PW12-R00, LXK2-PW12-S00, LXK2-PW14-U00, LXK2-PW14-V00 LXK2-PM12-R00, LXK2-PM12-S00, LXK2-PM14-U00 LXK2-PE12-Q00, LXK2-PE12-R00, LXK2-PE12-S00, LXK2-PE14-T00, LXK2-PE14-U00 LXK2-PB12-K00, LXK2-PB12-L00, LXK2-PB12-M00, LXK2-PB14-N00, LXK2-PB14-P00, LXK2-PB14-Q00 LXK2-PR12-L00, LXK2-PR12-M00, LXK2-PR14-Q00, LXK2-PR14-R00 LXK2-PD12-Q00, LXK2-PD12-R00, LXK2-PD12-S00 LXK2-PH12-R00, LXK2-PH12-S00 LXK2-PL12-P00, LXK2-PL12-Q00, LXK2-PL12-R00 Source: www.luxeon.com KINGBRIGHT: KA-3528ASYC Source: www.kingbright.com; PARTNO: LTST-C170KGKT
LOGO1 = GadgetFactory_Pub:BUTTERFLY_LOGO; BOM: EXCLUDE
PWR_1 = Papilio:POWER_ONLY; BOM: EXCLUDE
Q1-Q5 = transistor-pnp:*-?: PNP Transistor; PARTNO: MMBTA56
R1 R4-R6 = GadgetFactory:R: RESISTOR, European symbol; PARTNO: RMCF0603JT47K0
R2 R3 = GadgetFactory:R: RESISTOR, European symbol; PARTNO: RMCF0603JT3K30
R7-R10 R14 R18 R24 R30 = GadgetFactory:R: RESISTOR, European symbol; PARTNO: RMCF0603JT10K0
R11-R13 = GadgetFactory:R: RESISTOR, European symbol; PARTNO: RMCF0603JT390R
R15 R16 R19 R21 R23 R26 R28 R31 = GadgetFactory:R: RESISTOR, European symbol; PARTNO: RMCF0603JT220R
R17 R20 R22 R25 R27 R29 R32 R33 R48-R52 = GadgetFactory:R: RESISTOR, European symbol; PARTNO: CRCW0603100RJNEA
R34 R41 R45 = GadgetFactory:R: RESISTOR, European symbol; PARTNO: RMCF0603JT3K90
R35 R40 R44 = GadgetFactory:R: RESISTOR, European symbol; PARTNO: RMCF0603JT2K00
R36 R39 R43 = GadgetFactory:R: RESISTOR, European symbol; PARTNO: RMCF0603JT1K00
R37 R38 R42 = GadgetFactory:R: RESISTOR, European symbol; PARTNO: RMCF0603JT510R
R46 R47 = GadgetFactory:R: RESISTOR, European symbol; PARTNO: RMCF0603FT82R5
S1-S4 = adafruit:EVQQ2: SMT 6mm switch, EVQQ2 series http://www.ladyada.net/library/eagle; PARTNO: PTS525SM10SMTR LFS
SW0 SW1-SW7 = GadgetFactory_Pub_1_0:EG1218: SLIDING SWITCH 0.1" spacing through hole, vertical SPDT slide switch http://www.ladyada.net/library/pcb/eaglelibrary.html; PARTNO: EG1218
W1 = Papilio:WING8
X1 = GadgetFactory_6.0:F15: SUB-D; OC_FARNELL: unknown; OC_NEWARK: unknown; PARTNO: 1-1734530-1

## Board
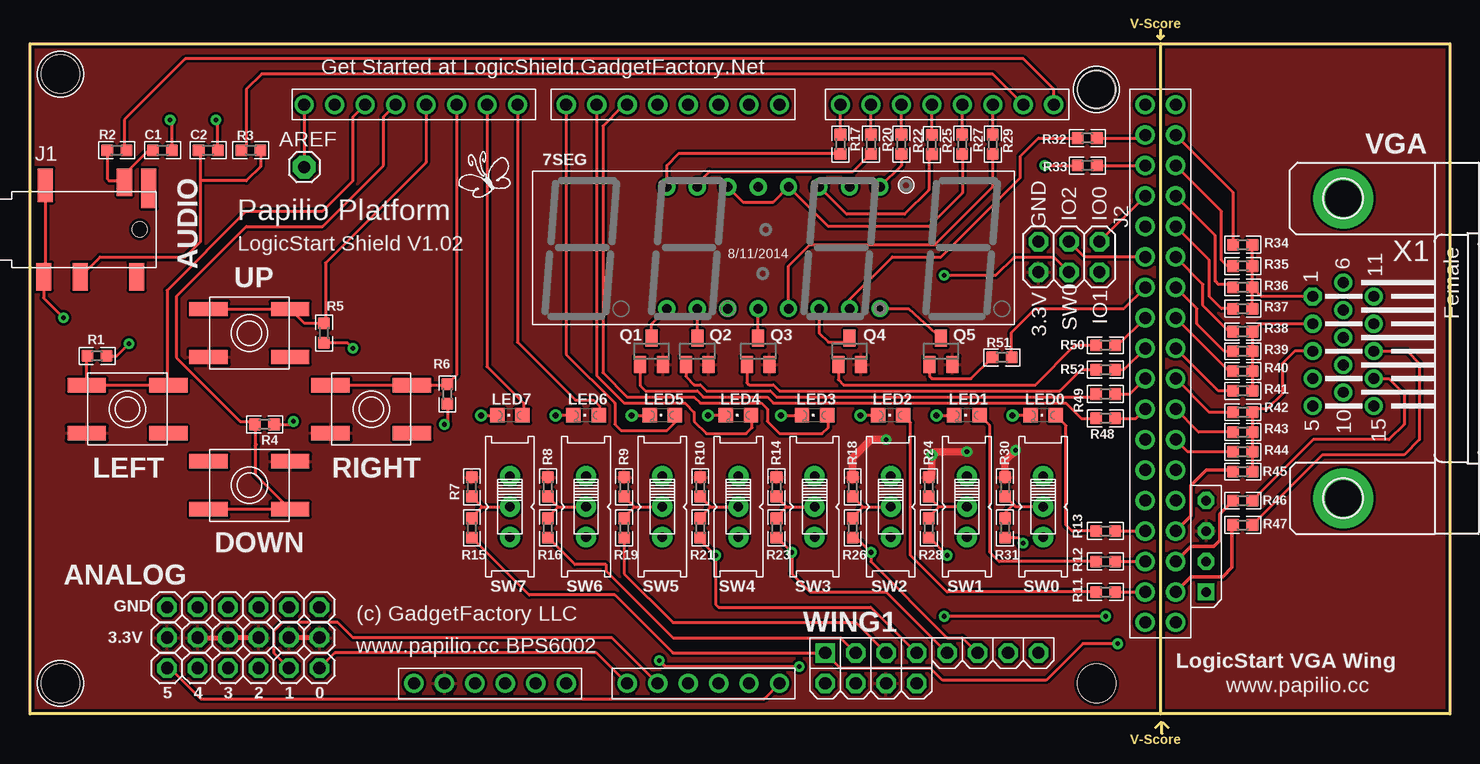
[diagram p7: board, top side]
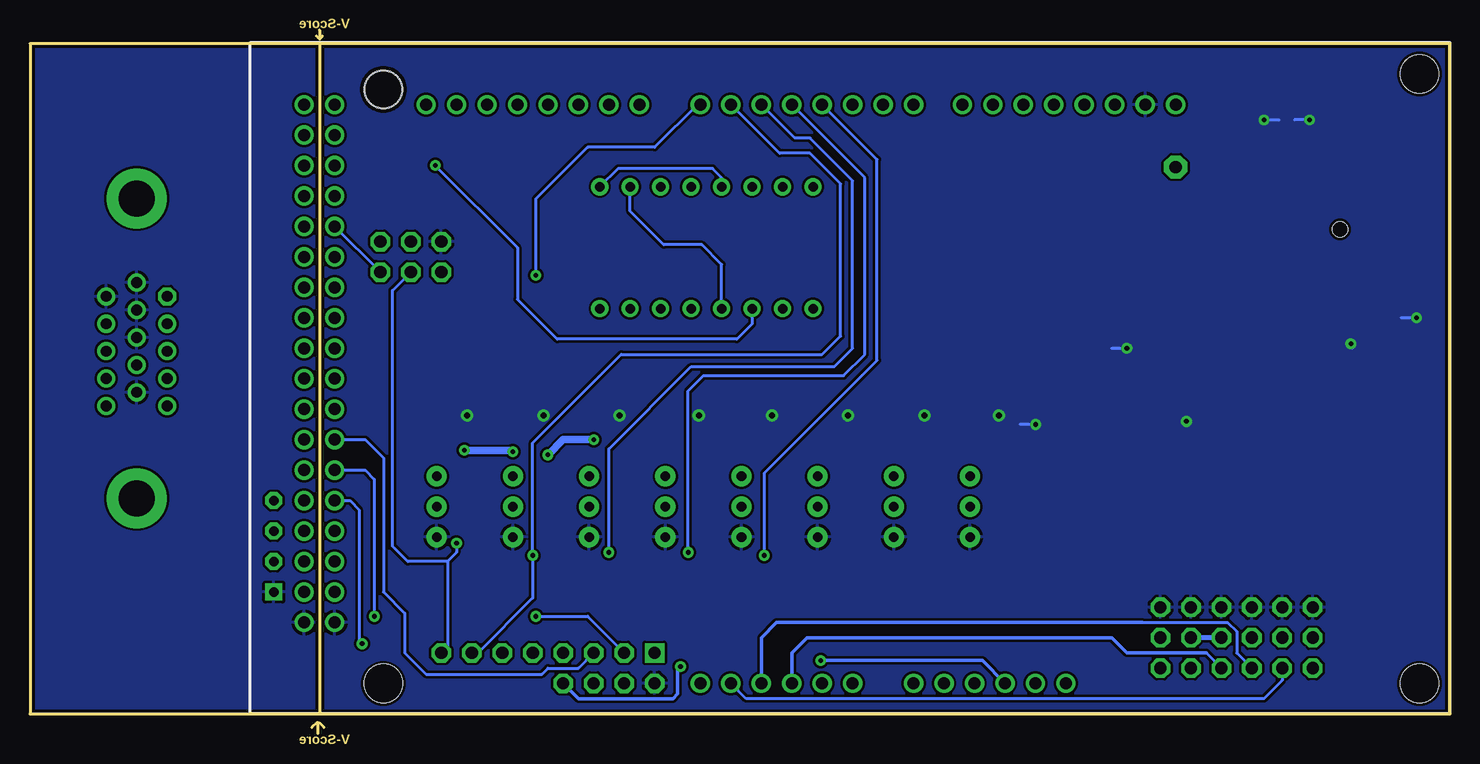
[diagram p8: board, bottom side, seen from below]

Size 118.36 x 58.67 mm. Coordinates in mm from the lower left corner, seen from the top.
Outline: 94.23,57.53 0,57.53 0,1.65 94.23,1.65
Outline: 94.23,57.53 118.36,57.53 118.36,1.65 94.23,1.65
Outline: 94.36,0 94.36,0.89
Outline: 94.36,0.89 94.23,0.89 93.85,0.51
Outline: 94.36,0.89 94.49,0.89 94.87,0.51
Outline: 94.23,58.67 94.23,57.91
Outline: 94.23,57.91 94.49,58.17
Outline: 94.23,57.91 93.98,58.17
Outline: 94.23,57.53 94.23,1.65
Copper layers (1*16): Top 0.035mm / dielectric 1.5mm / Bottom 0.035mm
Design rules "SparkFun_Derived_GoldePheonix_10mil": minimum track width 10mil, minimum drill 15mil, track to track 8mil, track to pad 8mil, pad to pad 8mil, via to via 8mil, smd to smd 8mil, copper to edge 10mil, drill to drill 8mil, minimum pad ring 12mil, minimum via ring 10mil, stop-mask expansion 4mil, vias tented up to drill 18mil, thermal gap 10mil

### Footprints (pad centres in the part's own frame; a part is rotated, then mirrored left to right if it is on the bottom)
7-SEGMENT-4DIGIT = drill 0.8 pad 1.422: 1 -8.89,-5.08; 2 -6.35,-5.08; 3 -3.81,-5.08; 4 -1.27,-5.08; 5 1.27,-5.08; 6 3.81,-5.08; 7 6.35,-5.08; 8 8.89,-5.08; 9 8.89,5.08; 10 6.35,5.08; 11 3.81,5.08; 12 1.27,5.08; 13 -1.27,5.08; 14 -3.81,5.08; 15 -6.35,5.08; 16 -8.89,5.08
1X01 = drill 1.016 pad 1.93 octagon: 1 0,0
0603 = smd 1 x 1: 1 -0.8,0; 2 0.8,0
PAPILIO_DUO_SHIELD = drill 1 pad 1.422: 3.3V 34.544,2.54; 5V@0 37.084,2.54; 5V@1 92.964,50.8; 5V@2 95.504,50.8; A0 49.784,2.54; A1 52.324,2.54; A2 54.864,2.54; A3 57.404,2.54; A4 59.944,2.54; A5 62.484,2.54; AREF 22.86,50.8; D2 57.404,50.8; D3 54.864,50.8; D4 52.324,50.8; D5 49.784,50.8; D6 47.244,50.8; D7 44.704,50.8; D8 40.64,50.8; D9 38.1,50.8; D10 35.56,50.8; D11 33.02,50.8; D12 30.48,50.8; D13 27.94,50.8; D14 67.564,50.8; D15 70.104,50.8; D16 72.644,50.8; D17 75.184,50.8; D18 77.724,50.8; D19 80.264,50.8; D20 82.804,50.8; D21 85.344,50.8; D22 92.964,48.26; D23 95.504,48.26; D24 92.964,45.72; D25 95.504,45.72; D26 92.964,43.18; D27 95.504,43.18; D28 92.964,40.64; D29 95.504,40.64; D30 92.964,38.1; D31 95.504,38.1; D32 92.964,35.56; D33 95.504,35.56; D34 92.964,33.02; D35 95.504,33.02; D36 92.964,30.48; D37 95.504,30.48; D38 92.964,27.94; D39 95.504,27.94; D40 92.964,25.4; D41 95.504,25.4; D42 92.964,22.86; D43 95.504,22.86; D44 92.964,20.32; D45 95.504,20.32; D46 92.964,17.78; D47 95.504,17.78; D48 92.964,15.24; D49 95.504,15.24; D50 92.964,12.7; D51 95.504,12.7; D52 92.964,10.16; D53 95.504,10.16; GND@0 39.624,2.54; GND@1 42.164,2.54; GND@2 25.4,50.8; GND@3 92.964,7.62; GND@4 95.504,7.62; RES 32.004,2.54; RX 62.484,50.8; TX 59.944,50.8; VIN 44.704,2.54 | hole 3.2: 88.9,52.07; 88.9,2.54; 2.54,2.54; 2.54,53.34
6P-SMD-3.5 = smd 1.27 x 2.286: COM1 2.413,3.937; L -4.318,-3.937; R -0.635,3.937; RS -5.334,3.937 | smd 1.27 x 2.794: COM2 2.286,-3.683 | smd 1.27 x 3.302: LS -6.35,-3.429 | hole 1.27: -5.588,0
2X03 = drill 1.016 octagon: 1 -2.54,-1.27; 2 -2.54,1.27; 3 0,-1.27; 4 0,1.27; 5 2.54,-1.27; 6 2.54,1.27
1X06 = drill 1.016 octagon: 1 -6.35,0; 2 -3.81,0; 3 -1.27,0; 4 1.27,0; 5 3.81,0; 6 6.35,0
CHIPLED_0805 = smd 1.2 x 1.2: A 0,-1.05; C 0,1.05
POWER_NO_TEXT = drill 0.8 square: P1 0,3.81 | drill 0.8 octagon: P2 0,1.27; P3 0,-1.27; P4 0,-3.81
SOT23 = smd 1 x 1.4: 1 -0.95,-1.1; 2 0.95,-1.1; 3 0,1.1
EVQ-Q2 = smd 3.2 x 1.2: A -3.4,-2; A' 3.4,-2; B -3.4,2; B' 3.4,2
EG1218 = drill 0.8 pad 1.676: O -2.54,0; P 0,0; S 2.54,0
STAND-OFF-TIGHT = hole 3.048: 0,0
WINGSIDE_8BIT_NOHOLES = drill 1.016 square: 0 19.05,1.27 | drill 1.016 octagon: 1 16.51,1.27; 2 13.97,1.27; 2V5@2 16.51,3.81; 3 11.43,1.27; 3V3@2 13.97,3.81; 4 8.89,1.27; 5 6.35,1.27; 5V@2 11.43,3.81; 6 3.81,1.27; 7 1.27,1.27; GND@2 19.05,3.81
HDF15H = drill 0.9 octagon: 1 4.329,2.54 | drill 0.9: 2 2.043,2.54; 3 -0.243,2.54; 4 -2.529,2.54; 5 -4.815,2.54; 6 5.472,0; 7 3.186,0; 8 0.9,0; 9 -1.386,0; 10 -3.672,0; 11 4.329,-2.54; 12 2.043,-2.54; 13 -0.243,-2.54; 14 -2.529,-2.54; 15 -4.815,-2.54 | drill 3 pad 5: P$1 -12.5,0; P$2 12.5,0

### Placement (x,y rotation side)
7SEG  61.98,40.51 0 top
AREF  22.86,47.24 0 top
C1  11.05,48.64 0 top
C2  14.86,48.64 0 top
H1  0,1.65 0 top
J1  3.56,42.04 180 top
J2  86.61,39.75 180 top
JP1  17.78,10.54 180 top
JP2  17.78,8 180 top
JP3  17.78,5.46 180 top
LED0  84.45,26.54 90 top
LED1  78.1,26.54 90 top
LED2  71.75,26.54 90 top
LED3  65.41,26.54 90 top
LED4  59.05,26.54 90 top
LED5  52.7,26.54 90 top
LED6  46.36,26.54 90 top
LED7  40.01,26.54 90 top
LOGO1  37.97,46.1 0 top
PWR_1  98.04,15.62 180 top
Q1  51.82,31.88 0 top
Q2  55.63,31.88 0 top
Q3  60.71,31.88 0 top
Q4  68.33,31.88 0 top
Q5  75.95,31.88 0 top
R1  5.59,31.5 180 top
R2  7.24,48.64 0 top
R3  18.41,48.64 180 top
R4  19.56,25.78 180 top
R5  24.51,33.4 90 top
R6  34.8,28.32 90 top
R7  36.83,20.57 90 top
R8  43.18,20.57 90 top
R9  49.53,20.57 90 top
R10  55.88,20.57 90 top
R11  89.66,11.81 0 top
R12  89.66,14.35 0 top
R13  89.66,16.89 0 top
R14  62.23,20.57 90 top
R15  36.83,17.14 90 top
R16  43.18,17.14 90 top
R17  67.56,49.15 270 top
R18  68.58,20.57 90 top
R19  49.53,17.14 90 top
R20  70.1,49.15 270 top
R21  55.88,17.14 90 top
R22  72.64,49.15 270 top
R23  62.23,17.14 90 top
R24  74.93,20.57 90 top
R25  75.18,49.12 270 top
R26  68.58,17.14 90 top
R27  77.72,49.15 270 top
R28  74.93,17.14 90 top
R29  80.26,49.15 270 top
R30  81.28,20.57 90 top
R31  81.28,17.14 90 top
R32  88.14,49.66 180 top
R33  88.14,47.37 180 top
R34  101.09,40.77 0 top
R35  101.09,38.99 0 top
R36  101.09,37.21 0 top
R37  101.09,35.43 0 top
R38  101.09,33.53 0 top
R39  101.09,31.88 0 top
R40  101.09,30.23 0 top
R41  101.09,28.57 0 top
R42  101.09,26.8 0 top
R43  101.09,25.15 0 top
R44  101.09,23.5 0 top
R45  101.09,21.84 0 top
R46  101.09,19.43 0 top
R47  101.09,17.4 0 top
R48  89.66,26.29 0 top
R49  89.66,28.32 0 top
R50  89.66,32.39 0 top
R51  81.03,31.37 0 top
R52  89.66,30.35 0 top
S1  8.13,27.05 180 top
S2  18.29,33.4 180 top
S3  18.29,20.7 0 top
S4  28.45,27.05 180 top
SW0  84.45,18.92 270 top
SW1  78.1,18.92 270 top
SW2  71.75,18.92 270 top
SW3  65.41,18.92 270 top
SW4  59.05,18.92 270 top
SW5  52.7,18.92 270 top
SW6  46.36,18.92 270 top
SW7  40.01,18.92 270 top
U$1  [STAND-OFF-TIGHT]  88.9,53.72 0 top
W1  85.34,8 180 top
X1  109.47,32.13 90 top

### Tracks (layer width: path | path; a pad name or v marks a point on that pad's centre or on a via)
3V3  (via drill 0.38)
  Top 0.406: JP2.1 JP2.2 | JP2.3 JP2.4 JP2.5
  Top 0.61: R18.2 68.58,22.99 70.1,24.51 v71.37,24.51 | R24.2 75.18,21.63 v75.18,23.24 75.44,23.5 v78.1,23.5 | R30.2 81.28,22.73 v82.17,23.62
  Bottom 0.406: JP2.3 JP2.2
  Bottom 0.61: v71.37,24.51 73.91,24.51 v75.18,23.24 | v82.17,23.62 78.23,23.62 v78.1,23.5
  pour Top: 0,1.65 94.23,1.65 94.23,57.53 0,57.53
5V0  (via drill 0.38)
  Top 0.305: v64.13,5.59 52.96,5.59 v52.45,6.1
  Bottom 0.305: W1.5V@2 72.64,2.92 64.77,2.92 64.39,3.3 64.39,5.33 v64.13,5.59 | v52.45,6.1 38.99,6.1 H1.5V@0
A
  Top 0.254: 58.67,45.34 58.42,45.59 7SEG.14 59.44,44.32 61.98,44.32 7SEG.12 66.55,42.29 74.93,42.29 77.72,45.09 R27.2
A0
  Top 0.254: JP3.1 25.4,6.73 47.24,6.73 H1.A0
A1
  Top 0.254: H1.A1 48.51,8 26.92,8 25.65,9.27 21.08,9.27 20.32,8.51 20.32,6.73 JP3.2
A2
  Bottom 0.254: 20.32,6.73 JP3.3
  Bottom 0.305: 20.32,6.73 26.92,6.73 28.19,8 53.59,8 54.86,6.73 H1.A2
A3
  Bottom 0.254: 25.65,9.27 18.54,9.27 17.78,8.51 17.78,6.73 JP3.4
  Bottom 0.305: 25.65,9.27 56.13,9.27 57.4,8 H1.A3
A4
  Bottom 0.254: JP3.5 13.97,4.45 15.49,2.92 58.67,2.92 H1.A4
A5
  Top 0.254: JP3.6 11.68,5.46 14.22,2.92 61.21,2.92 H1.A5
AN0
  Top 0.254: R48.2 92.2,26.29 H1.D40
AN1
  Top 0.254: R49.2 91.69,28.32 H1.D38
AN2
  Top 0.254: R50.2 90.68,32.39 H1.D34
AN3
  Top 0.254: R51.2 81.83,33.44 83.82,35.43 91.19,35.43 H1.D32
AN4
  Top 0.254: R52.2 91.19,30.35 H1.D36
APOS_A
  Top 0.254: 60.71,32.64 Q3.3 7SEG.4
  Bottom 0.254: 7SEG.4 60.71,39.12 62.36,40.77 65.53,40.77 68.33,43.56 7SEG.10
AUDIO-LEFT
  Top 0.254: H1.D21 85.34,53.72 82.8,56.26 12.95,56.26 7.87,51.18 7.87,48.81 R2.2
AUDIO-RIGHT
  Top 0.254: H1.D20 80.26,54.99 19.3,54.99 18.03,53.72 18.03,49.06 R3.2
B
  Top 0.254: 7SEG.16 53.09,47.37 54.1,48.39 67.53,48.39 R17.2
BLUE
  Top 0.254: X1.3 105.42,31.89 104.39,30.86 104.39,28.32 103.12,27.05 102.15,27.05 R42.2 R43.2 R44.2 R45.2
BLUE1
  Top 0.305: H1.D49 96.77,18.16 96.77,20.7 98.04,21.97 100.16,21.97 R45.1
BLUE2
  Top 0.254: R44.1 96.52,23.5 H1.D43
BLUE3
  Top 0.254: R43.1 97.41,25.15 H1.D41
BLUE4
  Top 0.254: R42.1 98.3,26.8 H1.D39
C
  Top 0.254: R22.2 72.64,47.37 7SEG.9
  Bottom 0.254: 7SEG.13 60.71,46.36 61.47,47.12 69.34,47.12 7SEG.9
D  (via drill 0.38)
  Top 0.254: v84.58,47.37 R33.2
  Bottom 0.254: 7SEG.3 58.17,34.16 59.44,32.89 74.42,32.89 77.72,36.2 77.72,40.51 v84.58,47.37
DIR_DOWN
  Top 0.254: 18.76,24 R4.2 18.5,26.04 17.53,26.04 12.19,31.37 12.19,36.45 18.03,42.29 24.38,42.29 29.46,47.37 29.46,51.44 H1.D12 | 18.76,24 18.76,21.63 S3.A' S3.A | 18.88,24.13 18.76,24
DIR_LEFT
  Top 0.254: R1.2 4.73,31.44 S1.A' S1.A 11.43,29.15 11.43,36.96 18.03,43.56 24.38,43.56 26.92,46.1 26.92,51.44 H1.D13
DIR_RIGHT
  Top 0.254: H1.D10 35.56,29.88 R6.2 34.73,29.05 S4.A S4.A'
DIR_UP
  Top 0.254: R5.2 22.89,34.2 S2.A S2.A' | H1.D11 33.02,47.62 24.64,39.24 24.64,34.33 R5.2 | 24.55,34.16 R5.2
DP
  Top 0.254: 7SEG.7 68.33,36.2 71.88,39.75 75.95,39.75 82.55,46.36 82.55,48.13 84.07,49.66 R32.2
E
  Top 0.254: 7SEG.5 63.25,38.99 65.02,40.77 75.44,40.77 80.26,45.59 R29.2
F
  Top 0.254: R25.2 75.12,48.32 74.93,48.13 74.93,45.34 72.9,43.31 68.07,43.31 7SEG.11
G
  Top 0.254: 7SEG.15 55.63,45.85 56.64,46.86 68.62,46.86 R20.2
GND  (via drill 0.38, 0.5)
  Top 0.254: LED2.C v69.21,26.54 | v75.56,26.54 LED1.C | v62.61,26.54 LED3.C | LED4.C v56.52,26.54 | v50.16,26.54 LED5.C | LED6.C v43.82,26.54 | LED0.C v81.91,26.54 | v37.59,26.54 LED7.C | R1.1 7.24,31.5 v8.26,32.51 | R4.1 21.72,25.78 v21.97,26.04 | C1.2 11.85,51.02 v11.68,51.18 | C2.2 15.66,51.02 v15.49,51.18 | R5.1 26.45,32.6 v26.92,32.13 | R6.1 34.8,26.04 v34.54,25.78 | J1.COM2 1.27,38.23 J1.COM1 1.14,36.32 v2.79,34.67
  Bottom 0.254: v8.26,32.51 8.26,32.26 8.13,32.13 | v21.97,26.04 21.97,26.29 | v2.79,34.67 4.06,34.67 | v11.68,51.18 12.95,51.18 | v15.49,51.18 14.22,51.18 | v26.92,32.13 28.19,32.13 | v34.54,25.78 35.81,25.78
  pour Bottom: 0,1.65 94.23,1.65 94.23,57.53 0,57.53
GPIO0
  Top 0.254: H1.D26 J2.1
GPIO1
  Bottom 0.254: J2.2 H1.D28
GPIO2
  Top 0.254: H1.D30 87.88,39.75 J2.3
GREEN
  Top 0.254: X1.2 102.54,34.17 R38.2 R39.2 R40.2 R41.2
GREEN1
  Top 0.254: R41.1 99.06,28.57 H1.D37
GREEN2
  Top 0.254: R40.1 99.95,30.23 H1.D35
GREEN3
  Top 0.254: R39.1 99.57,31.88 97.28,34.16 97.28,35.43 H1.D33
GREEN4
  Top 0.254: R38.1 99.95,33.53 97.79,35.69 97.79,37.47 H1.D31
HORIZONTAL_SYNC
  Top 0.305: H1.D53 96.77,13.08 99.44,13.08 100.2,13.84 100.2,17.31 R47.1
LED0
  Top 0.254: R13.2 H1.D48
LED1
  Top 0.254: R12.2 H1.D50
LED2
  Top 0.254: R11.2 H1.D52
LED3
  Top 0.254: H1.D5 49.53,52.2 49.28,52.2 47.75,50.67 47.75,30.1 49.78,28.07 55.37,28.07 55.88,27.56 60.96,27.56 61.47,27.05 61.47,26.04 62.48,25.02 66.04,25.02 66.55,25.53 66.55,26.45 LED3.A 66.55,26.64
LED4
  Top 0.254: H1.D6 47.24,29.84 49.53,27.56 54.61,27.56 55.37,26.8 55.37,26.04 56.39,25.02 59.69,25.02 60.2,25.53 60.2,26.45 LED4.A 60.2,26.64
LED5
  Top 0.254: H1.D7 44.7,31.62 48.77,27.56 48.77,25.78 49.28,25.27 53.09,25.27 53.85,26.04 53.85,26.45 LED5.A
LED6
  Top 0.254: H1.D8 40.64,32.64 45.47,27.81 46.99,27.81 47.5,27.3 47.5,26.64 LED6.A
LED7
  Top 0.254: H1.D9 38.1,30.61 41.15,27.56 41.15,26.64 LED7.A
N$1
  Top 0.254: C1.1 10.25,48.48 9.74,48.48 7.75,46.48 7.75,46.1 | R2.1 6.44,46.27 6.6,46.1 7.75,46.1 | 7.75,46.1 J1.L
N$2
  Top 0.254: Q1.1 50.87,29.02 51.31,28.57 55.63,28.57 56.13,28.07 61.47,28.07 61.98,27.56 86.36,27.56 87.63,26.29 R48.1
N$3
  Top 0.254: Q2.1 54.68,29.78 55.37,29.08 55.88,29.08 56.39,28.57 61.72,28.57 62.23,28.07 88.61,28.07 R49.1
N$4
  Top 0.254: X1.13 114.8,31.89 115.82,30.86 115.82,24.51 114.55,23.24 107.73,23.24 R47.2
N$5
  Top 0.254: X1.14 113.27,29.6 114.55,28.32 114.55,25.78 113.28,24.51 106.97,24.51 R46.2
N$6
  Top 0.254: Q4.1 67.38,29.52 67.82,29.08 83.82,29.08 87.12,32.39 R50.1
N$7
  Top 0.254: Q5.1 75,29.78 75.18,29.59 78.45,29.59 R51.1
N$8
  Top 0.254: Q3.1 59.76,29.27 59.94,29.08 61.98,29.08 62.48,28.57 85.85,28.57 87.63,30.35 R52.1
N$9
  Top 0.254: H1.AREF AREF.1
N$19
  Top 0.254: R13.1 86.87,16.89 86.36,17.4 86.36,25.69 LED0.A
N$20
  Top 0.254: R12.1 80.77,14.35 80.01,15.11 80.01,25.69 LED1.A
N$21
  Top 0.254: R11.1 76.45,11.81 73.41,14.86 73.41,25.94 LED2.A
N$29
  Top 0.254: Q1.3 51.82,34.16 7SEG.1
N$30
  Top 0.254: Q2.3 7SEG.2
N$31
  Top 0.254: 7SEG.6 65.79,33.4 66.55,32.64 68.24,32.64 Q4.3
N$32
  Top 0.254: 7SEG.8 73.24,35.43 Q5.3
N$33
  Top 0.254: 14.22,46.1 14.22,41.02 12.95,39.75 5.84,39.75 J1.R | 14.22,46.1 14.22,48.48 C2.1 | R3.1 19.22,47.28 18.03,46.1 14.22,46.1
RED
  Top 0.254: X1.1 102.64,36.46 R36.2 | R37.2 R36.2 | R36.2 R35.2 R34.2
RED1
  Top 0.254: R34.1 100.29,45.12 H1.D23
RED2
  Top 0.254: R35.1 99.82,38.99 99.31,39.5 99.31,43.56 H1.D25
RED3
  Top 0.254: R36.1 100.08,37.21 99.82,37.47 99.06,37.47 98.81,37.72 98.81,41.53 H1.D27
RED4
  Top 0.254: R37.1 99.31,35.43 98.3,36.45 98.3,39.5 H1.D29
SEGA
  Top 0.254: R27.1 H1.D18
SEGB
  Top 0.254: R17.1 H1.D14
SEGC
  Top 0.254: R22.1 H1.D16
SEGD
  Top 0.254: R33.1 H1.D24
SEGDP
  Top 0.254: R32.1 92.71,49.66 H1.D22
SEGE
  Top 0.254: R29.1 H1.D19
SEGF
  Top 0.254: R25.1 H1.D17
SEGG
  Top 0.254: R20.1 H1.D15
SW0  (via drill 0.38)
  Top 0.254: R31.1 82.33,16.35 v82.8,15.88 | v76.2,38.23 80.52,38.23 82.04,39.75 85.34,39.75 J2.4
  Bottom 0.254: v82.8,15.88 82.8,15.11 83.57,14.35 | 83.57,14.35 86.87,14.35 88.14,15.62 88.14,36.96 J2.4 | H1.RX 62.74,52.45 66.29,48.9 71.88,48.9 76.2,44.58 v76.2,38.23 | 83.57,14.35 83.57,7.24 W1.7
SW0_JOY_UP_IN
  Top 0.254: SW0.P 82.13,18.92 81.96,19.09 | 81.96,19.09 R30.1 | R31.2 81.28,18.41 81.96,19.09
SW1  (via drill 0.38)
  Top 0.254: R28.1 74.97,16.35 v76.45,14.86
  Bottom 0.254: H1.TX 55.88,48.39 53.34,48.39 50.8,45.85 50.8,33.15 52.32,31.62 69.09,31.62 76.45,24.26 v76.45,14.86 76.45,11.3 81.03,6.73 W1.6
SW1__JOY_DOWN_IN
  Top 0.254: SW1.P 75.78,18.92 | 75.78,18.92 R24.1 | R28.2 74.93,18.07 75.78,18.92
SW2  (via drill 0.38)
  Top 0.254: R26.1 68.87,16.35 v70.1,15.11 70.1,14.35 76.45,8 77.72,8 W1.5
  Bottom 0.254: v70.1,15.11 70.1,23.75 63.25,30.61 51.31,30.61 49.78,32.13 49.78,46.1 53.34,49.66 54.61,49.66 H1.D2
SW2_JOY_SELECT_IN
  Top 0.254: 69.43,18.92 SW2.P | R18.1 69.43,18.92 | R26.2 68.58,18.07 69.43,18.92
SW3  (via drill 0.38)
  Top 0.254: R23.1 62.27,16.35 v63.5,15.11 63.5,13.33 65.02,11.81 71.37,11.81 W1.4
  Bottom 0.254: v63.5,15.11 63.5,28.57 62.23,29.84 50.55,29.84 48.77,31.62 48.77,46.36 H1.D3
SW3_JOY_RIGHT_IN
  Top 0.254: 63.08,18.92 SW3.P | R14.1 63.08,18.92 | R23.2 62.23,18.07 63.08,18.92
SW4  (via drill 0.38)
  Top 0.254: R21.1 55.88,16.13 v57.15,14.86 57.15,10.79 57.4,10.54 70.1,10.54 W1.3
  Bottom 0.254: v57.15,14.86 57.15,21.72 47.75,31.11 47.75,47.88 H1.D4
SW4_JOY_LEFT_IN
  Top 0.254: 56.73,18.92 SW4.P | R10.1 56.73,18.92 | R21.2 55.88,18.07 56.73,18.92
SW5
  Top 0.254: R19.1 49.53,13.33 53.59,9.27 68.83,9.27 W1.2
  Bottom 0.254: H1.D42 90.42,24.51 88.9,22.99 88.9,11.81 87.12,10.03 87.12,6.73 85.34,4.95 75.69,4.95 75.18,5.46 72.64,5.46 W1.2
SW5_IN
  Top 0.254: 50.38,18.92 SW5.P | R9.1 50.38,18.92 | R19.2 49.53,18.07 50.38,18.92
SW6  (via drill 0.38)
  Top 0.254: R16.1 45.43,14.1 48.01,14.1 48.01,13.59 53.59,8 67.56,8 W1.1 | v89.66,9.78 v76.2,9.78
  Bottom 0.254: H1.D44 90.42,21.97 89.66,21.21 v89.66,9.78 | v76.2,9.78 71.88,9.78 W1.1
SW6_IN
  Top 0.254: 44.03,18.92 SW6.P | R8.1 44.03,18.92 | R16.2 43.18,18.07 44.03,18.92
SW7  (via drill 0.38)
  Top 0.254: R15.1 41.62,11.56 48.77,11.56 53.59,6.73 W1.0 67.56,5.46 75.06,5.46 76.07,4.45 84.71,4.45 87.76,7.49 v90.68,7.49
  Bottom 0.254: H1.D46 91.69,19.43 90.93,18.67 90.93,7.75 v90.68,7.49
SW7_IN
  Top 0.254: 37.68,18.92 SW7.P | R7.1 37.68,18.92 | R15.2 36.83,18.07 37.68,18.92
VERTICAL_SYNC
  Top 0.305: H1.D51 96.77,15.62 98.68,15.62 99.19,16.13 99.19,18.33 R46.1
WING_3V3
  pour Top: 94.23,57.53 118.36,57.53 118.36,1.65 94.23,1.65
WING_GND
  pour Bottom: 94.23,57.53 118.36,57.53 118.36,1.65 94.23,1.65

### Text on the board
Dimension: V-Score | V-Score
tPlace: Get Started at LogicShield.GadgetFactory.Net | VGA | GND | IO2 | IO0 | Papilio Platform | LogicStart Shield V1.02 | AUDIO | UP | SW0 | IO1 | 3.3V | LEFT | RIGHT | DOWN | ANALOG | GND | WING1 | (c) GadgetFactory LLC | 3.3V | www.papilio.cc BPS6002 | www.papilio.cc | 5 | 4 | 3 | 2 | 1 | 0
tNames: 8/11/2014 | LogicStart VGA Wing